# EAGLE design Dashboard rev5 (EAGLE 9.6.2)

## Sheet 1 of 4
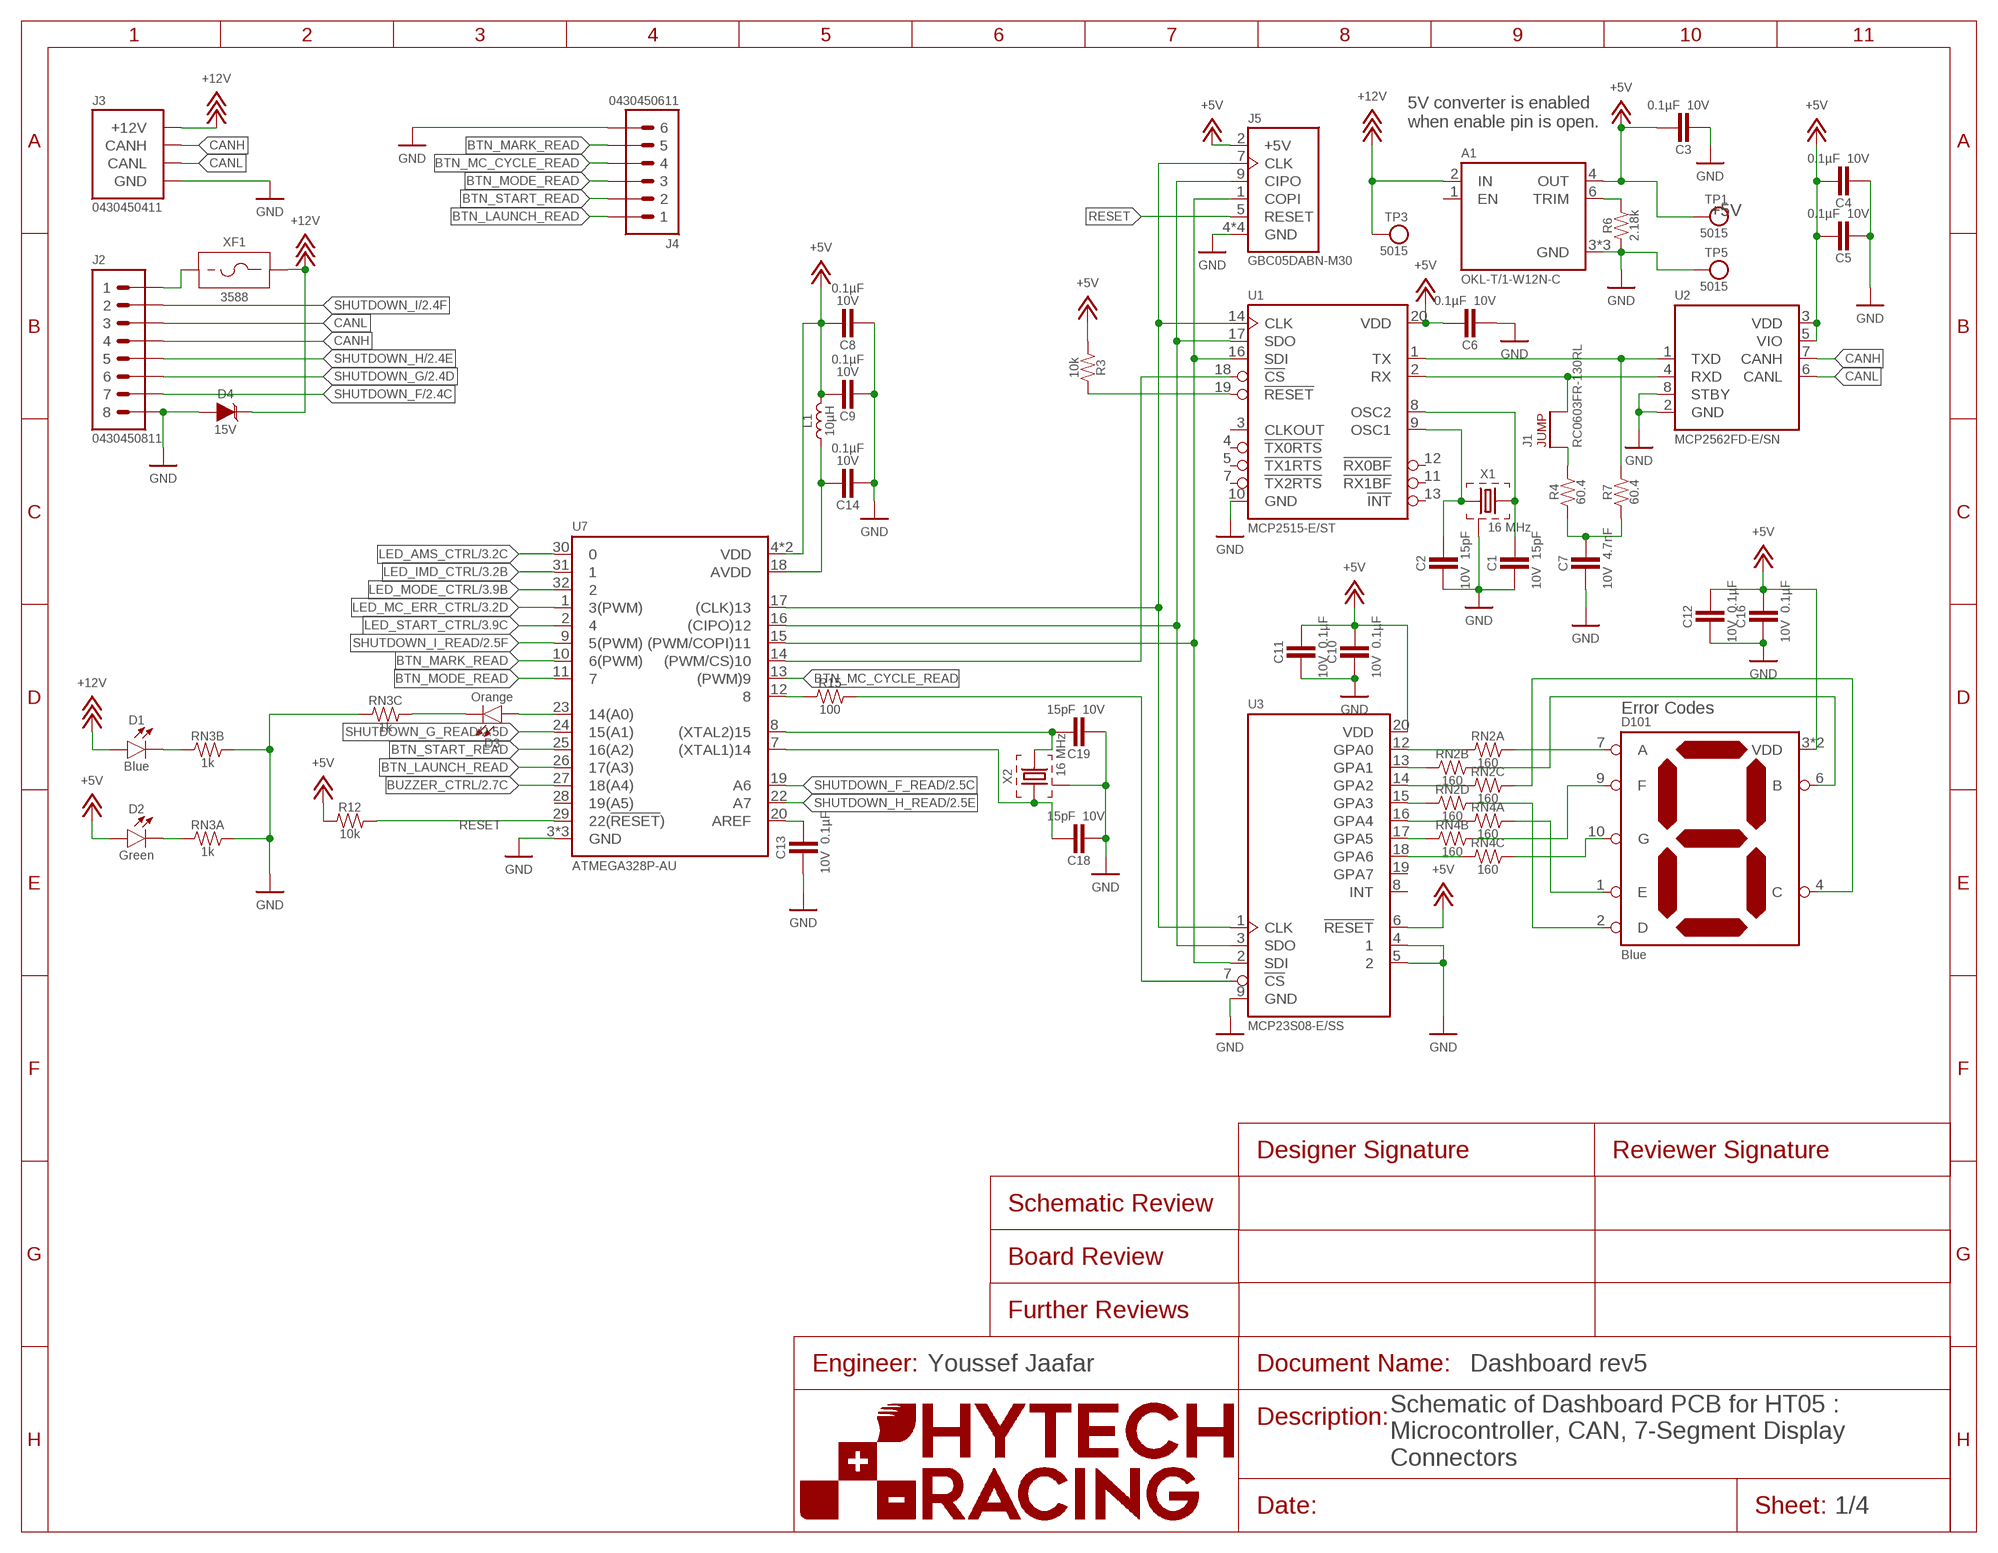
[diagram p0: schematic, sheet 1]

### Parts
A1  OKL-T/1-W12N-COKL  [OKL-T/1-W12]
C1  CAPACITOR_0603_10V_15PF  [0603-CAP]
C2  CAPACITOR_0603_10V_15PF  [0603-CAP]
C3  CAPACITOR_0603_10V_0.1UF  [0603-CAP]
C4  CAPACITOR_0603_10V_0.1UF  [0603-CAP]
C5  CAPACITOR_0603_10V_0.1UF  [0603-CAP]
C6  CAPACITOR_0603_10V_0.1UF  [0603-CAP]
C7  CAPACITOR_0603_10V_4.7NF  [0603-CAP]
C8  CAPACITOR_0603_10V_0.1UF  [0603-CAP]
C9  CAPACITOR_0603_10V_0.1UF  [0603-CAP]
C10  CAPACITOR_0603_10V_0.1UF  [0603-CAP]
C11  CAPACITOR_0603_10V_0.1UF  [0603-CAP]
C12  CAPACITOR_0603_10V_0.1UF  [0603-CAP]
C13  CAPACITOR_0603_10V_0.1UF  [0603-CAP]
C14  CAPACITOR_0603_10V_0.1UF  [0603-CAP]
C16  CAPACITOR_0603_10V_0.1UF  [0603-CAP]
C18  CAPACITOR_0603_10V_15PF  [0603-CAP]
C19  CAPACITOR_0603_10V_15PF  [0603-CAP]
D1  LED_0603_BLUE  [0603-LED]
D2  LED_0603_GREEN  [0603-LED]
D3  LED_0603_ORANGE  [0603-LED]
D4  TVS_15V  [SOT-23]
D101  LED_7_SEGMENT_BLUE_DSM7TA  [DSM7T]
J1  JUMPER_0603_  [0603-RES]
J2  CONNECTOR-8_μF_S_RA_  [MOLEX_MICROFIT_SMD_RIGHTANGLE_08_DUAL]
J3  CONNECTOR-CAN_μF_S_RA_  [MOLEX_MICROFIT_SMD_RIGHTANGLE_04_DUAL]
J4  CONNECTOR-6_μF_S_RA_  [MOLEX_MICROFIT_SMD_RIGHTANGLE_06_DUAL]
J5  CONNECTOR-AVR-ISP_2X05_SMD  [2X05_SMD]
L1  INDUCTOR_LQM18DH100M70_10UH  [0603-IND]
R3  RESISTOR_0603_10K  [0603-RES]
R4  RESISTOR_0603_60.4  [0603-RES]
R6  RESISTOR_0603_2.18K  [0603-RES]
R7  RESISTOR_0603_60.4  [0603-RES]
R12  RESISTOR_0603_10K  [0603-RES]
R15  RESISTOR_0603_100  [0603-RES]
RN2  RESISTOR_NETWORK_4_160  [1206-RES-ARRAY]
RN3  RESISTOR_NETWORK_4_1K  [1206-RES-ARRAY]
RN4  RESISTOR_NETWORK_4_160  [1206-RES-ARRAY]
TP1  TEST_POINT  [5015]
TP3  TEST_POINT  [5015]
TP5  TEST_POINT  [5015]
U1  MCP2515  [TSSOP-20]
U2  MCP2562FD  [SOIC-08(NARROW,0.15")]
U3  MCP23S08  [SSOP-20]
U7  ATMEGA328P-AU  [TQFP-32]
X1  CRYSTAL_16MHZ  [ECX-42]
X2  CRYSTAL_16MHZ  [ECX-42]
XF1  FUSE_HOLDER_MINIBLADESMD  [3588]

### Nets
+5V: A1.4(OUT) C3.1 C4.1 C5.1 C6.1 C8.1 C9.1 C10.1 C11.1 C12.1 C16.1 D2.2(A) D101.3(VDD) D101.8(VDD) J5.2(+5V) L1.2 R3.1 R12.1 TP1.1 U1.20(VDD) U2.3(VDD) U2.5(VIO) U3.6(!RESET) U3.20(VDD) U7.4(VDD) U7.6(VDD) ; also sheet 3
+12V: A1.2(IN) D1.2(A) D4.3(C) J3.1(+12V) TP3.1 XF1.3 XF1.4 ; also sheet 2
A2: RN2.1 U3.12(GPA0)
B2: RN2.2 U3.13(GPA1)
BTN_LAUNCH_READ: J4.1 U7.26(17(A3))
BTN_MARK_READ: J4.5 U7.10(6(PWM))
BTN_MC_CYCLE_READ: J4.4 U7.13((PWM)9)
BTN_MODE_READ: J4.3 U7.11
BTN_START_READ: J4.2 U7.25(16(A2))
BUZZER_CTRL: U7.27(18(A4)) ; also sheet 2
C2: RN2.3 U3.14(GPA2)
CANH: J2.4 J3.4(CANH) U2.7(CANH)
CANL: J2.3 J3.3(CANL) U2.6(CANL)
CIPO: J5.9(CIPO) U1.17(SDO) U3.3(SDO) U7.16((CIPO)12)
CLK: J5.7(CLK) U1.14(CLK) U3.1(CLK) U7.17((CLK)13)
COPI: J5.1(COPI) U1.16(SDI) U3.2(SDI) U7.15((PWM/COPI)11)
CS_CAN: U1.18(!CS) U7.14((PWM/CS)10)
CS_IO: R15.2 U3.7(!CS)
D2: RN2.4 U3.15(GPA3)
E2: RN4.1 U3.16(GPA4)
F2: RN4.2 U3.17(GPA5)
G2: RN4.3 U3.18(GPA6)
GND: A1.3(GND) A1.7(GND) A1.11(GND) C1.2 C2.2 C3.2 C4.2 C5.2 C6.2 C7.2 C8.2 C9.2 C10.2 C11.2 C12.2 C13.2 C14.2 C16.2 C18.2 C19.2 D4.1(A) J2.8 J3.2(GND) J4.6 J5.4(GND) J5.6(GND) J5.8(GND) J5.10(GND) R6.1 RN3.3 RN3.7 RN3.8 TP5.1 U1.10(GND) U2.2(GND) U2.8(STBY) U3.4 U3.5 U3.9(GND) U7.3(GND) U7.5(GND) U7.21(GND) X1.2(GND) X1.4(GND) X2.2(GND) X2.4(GND) ; also sheet 2,3
LED_AMS_CTRL: U7.30 ; also sheet 3
LED_IMD_CTRL: U7.31 ; also sheet 3
LED_MC_ERR_CTRL: U7.1(3(PWM)) ; also sheet 3
LED_MODE_CTRL: U7.32 ; also sheet 3
LED_START_CTRL: U7.2 ; also sheet 3
N$1: C2.1 U1.9(OSC1) X1.1
N$3: C19.1 U7.8((XTAL2)15) X2.3
N$4: C13.1 U7.20(AREF)
N$11: C18.1 U7.7((XTAL1)14) X2.1
N$13: D101.7(A) RN2.8
N$14: D101.6(B) RN2.7
N$15: D101.4(C) RN2.6
N$16: D101.10(G) RN4.6
N$17: D101.9(F) RN4.7
N$18: D101.1(E) RN4.8
N$19: D101.2(D) RN2.5
N$21: D2.1(C) RN3.1
N$29: R15.1 U7.12
N$30: A1.6(TRIM) R6.2
N$41: J1.2 U1.2(RX) U2.4(RXD)
N$42: C1.1 U1.8(OSC2) X1.3
N$43: J2.1 XF1.1 XF1.2
N$44: D3.2(A) U7.23(14(A0))
N$46: R3.2 U1.19(!RESET)
N$51: J1.1 R4.2
N$52: C7.1 R4.1 R7.1
N$53: R7.2 U1.1(TX) U2.1(TXD)
N$60: C14.1 L1.1 U7.18(AVDD)
RESET: J5.5(RESET) R12.2 U7.29(22(!RESET!))
SHUTDOWN_F: J2.7 ; also sheet 2
SHUTDOWN_F_READ: U7.19(A6) ; also sheet 2,3
SHUTDOWN_G: J2.6 ; also sheet 2
SHUTDOWN_G_READ: U7.24(15(A1)) ; also sheet 2,3
SHUTDOWN_H: J2.5 ; also sheet 2
SHUTDOWN_H_READ: U7.22(A7) ; also sheet 2
SHUTDOWN_I: J2.2 ; also sheet 2
SHUTDOWN_I_READ: U7.9(5(PWM)) ; also sheet 2,3
STATUS_12V: D1.1(C) RN3.2
STATUS_TEENSY: D3.1(C) RN3.6
Unconnected: A1.1(EN) RN3.4 RN3.5 RN4.4 RN4.5 U1.3(CLKOUT) U1.4(!TX0RTS) U1.5(!TX1RTS) U1.7(!TX2RTS) U1.11(!RX1BF) U1.12(!RX0BF) U1.13(!INT) U3.8(INT) U3.19(GPA7) U7.28(19(A5))

### Notes on the sheet
- 5V converter is enabled 
  when enable pin is open.
- Error Codes
- Youssef Jaafar
- Schematic of Dashboard PCB for HT05 :
  Microcontroller, CAN, 7-Segment Display
  Connectors

## Sheet 2 of 4
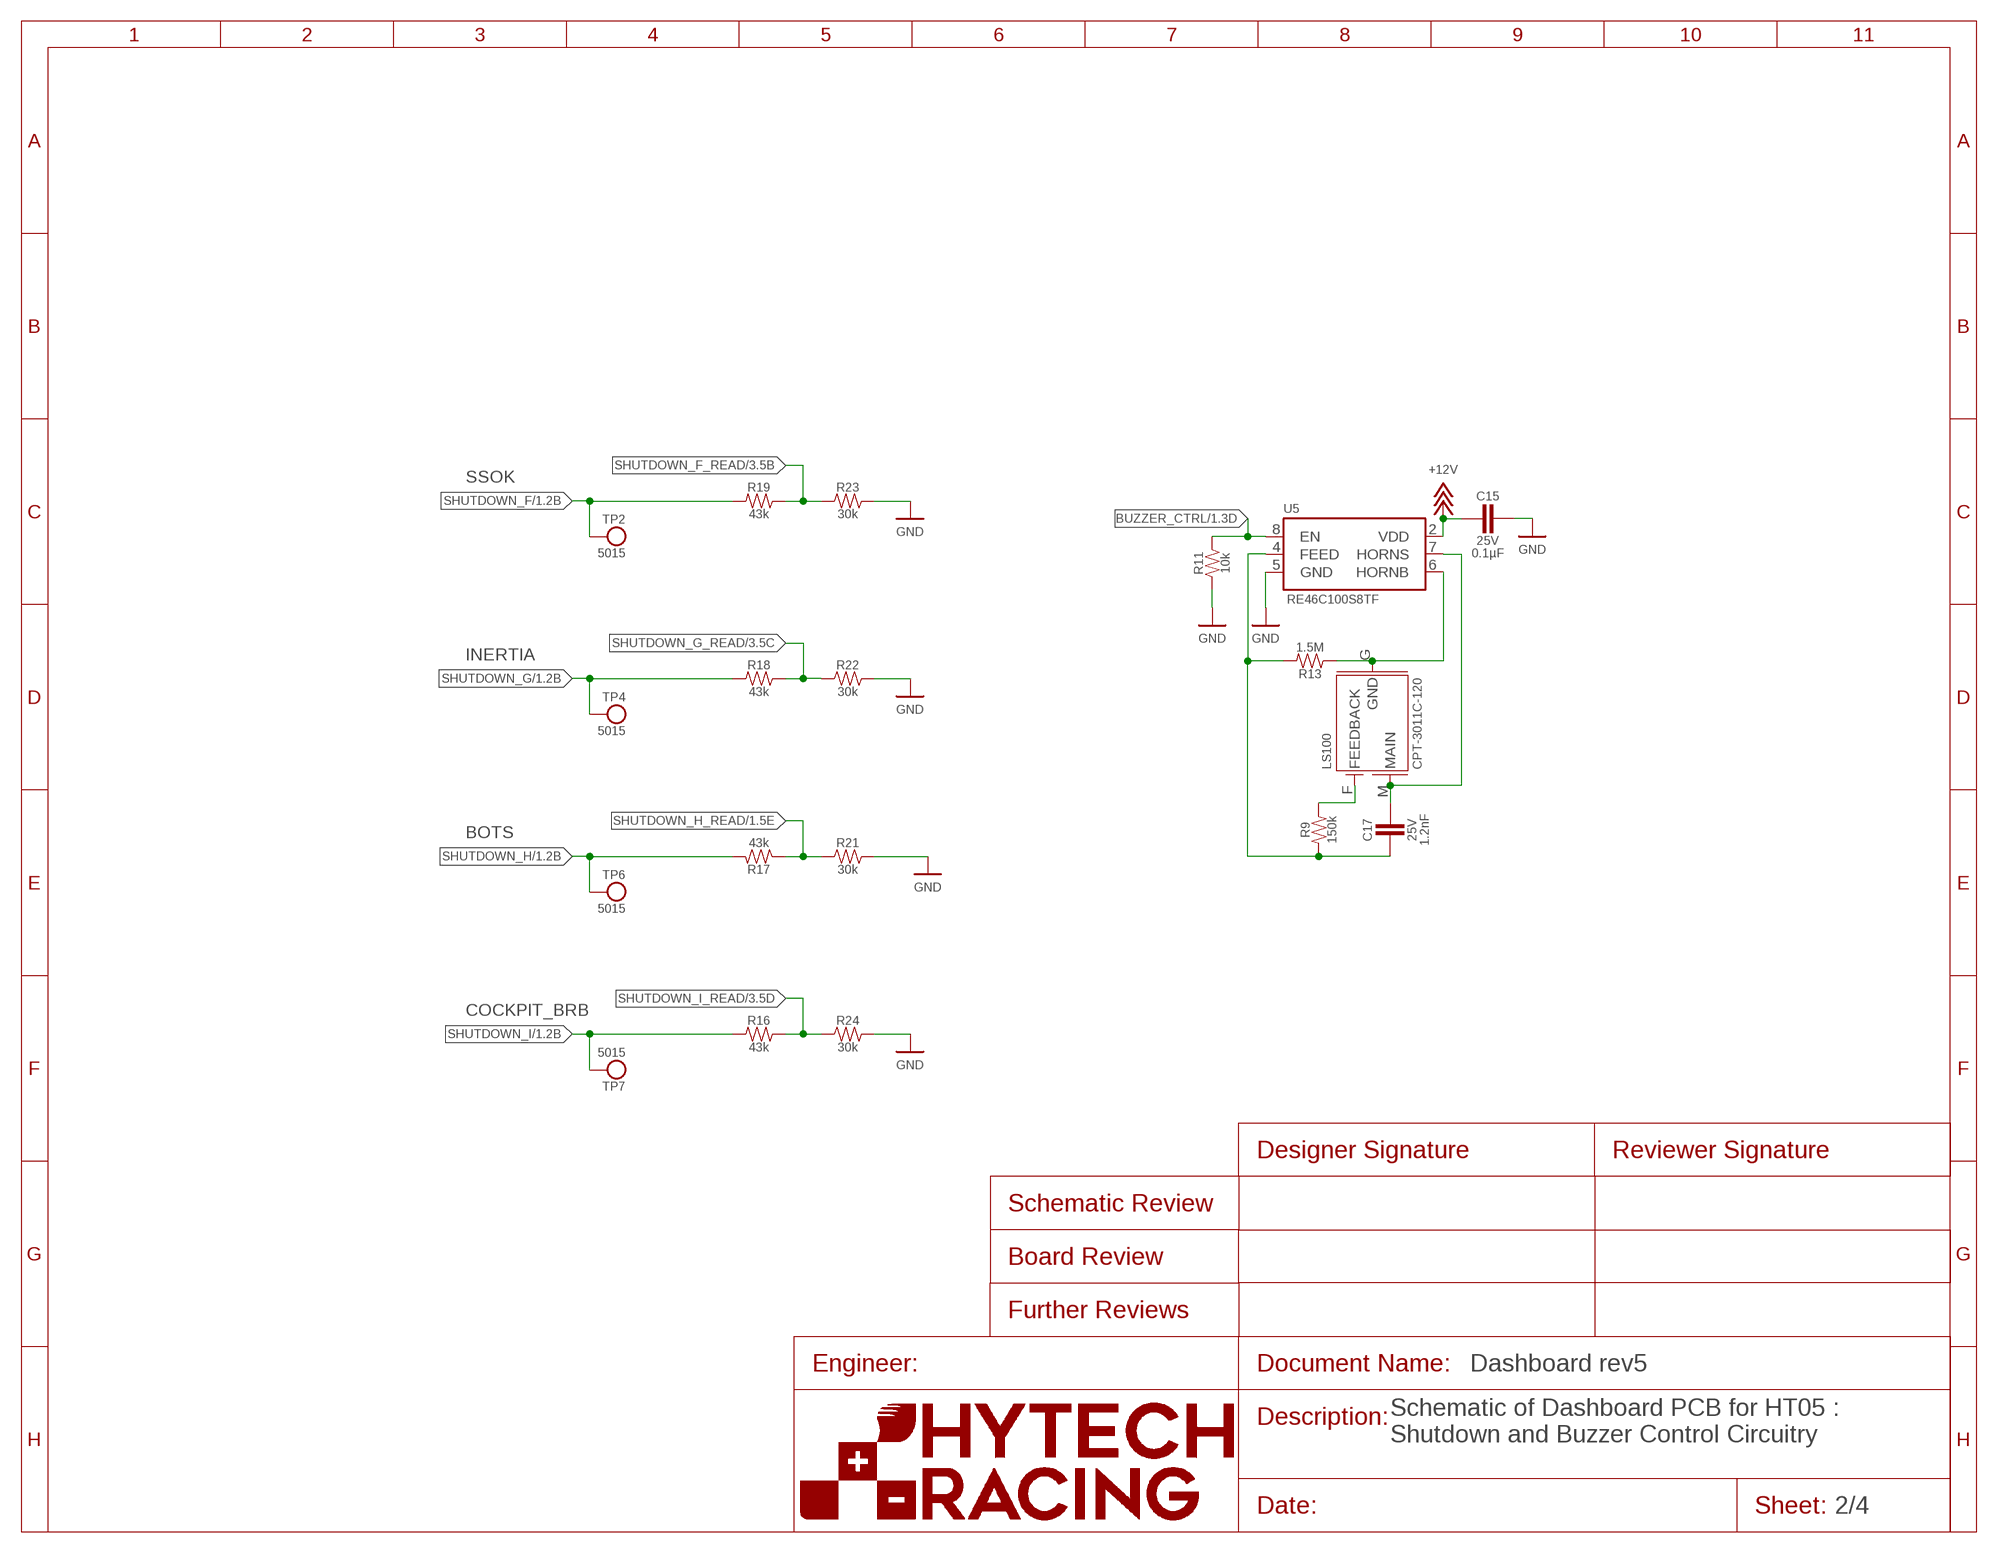
[diagram p1: schematic, sheet 2]

### Parts
C15  CAPACITOR_0603_25V_0.1UF  [0603-CAP]
C17  CAPACITOR_0603_25V_1.2NF  [0603-CAP]
LS100  BUZZER_3_PIN_CPT-3011C-120  [CPT-3011C-120]
R9  RESISTOR_0603_150K  [0603-RES]
R11  RESISTOR_0603_10K  [0603-RES]
R13  RESISTOR_0603_1.5M  [0603-RES]
R16  RESISTOR_0603_43K  [0603-RES]
R17  RESISTOR_0603_43K  [0603-RES]
R18  RESISTOR_0603_43K  [0603-RES]
R19  RESISTOR_0603_43K  [0603-RES]
R21  RESISTOR_0603_30K  [0603-RES]
R22  RESISTOR_0603_30K  [0603-RES]
R23  RESISTOR_0603_30K  [0603-RES]
R24  RESISTOR_0603_30K  [0603-RES]
TP2  TEST_POINT  [5015]
TP4  TEST_POINT  [5015]
TP6  TEST_POINT  [5015]
TP7  TEST_POINT  [5015]
U5  RE46C100  [SOIC-08(NARROW,0.15")]

### Nets
+12V: C15.2 U5.2(VDD) ; also sheet 1
BUZZER_CTRL: R11.2 U5.8(EN) ; also sheet 1
GND: C15.1 R11.1 R21.2 R22.2 R23.2 R24.2 U5.5(GND) ; also sheet 1,3
N$28: C17.1 LS100.M(MAIN) U5.7(HORNS)
N$39: LS100.G(GND) R13.1 U5.6(HORNB)
N$50: C17.2 R9.1 R13.2 U5.4(FEED)
N$54: LS100.F(FEEDBACK) R9.2
SHUTDOWN_F: R19.1 TP2.1 ; also sheet 1
SHUTDOWN_F_READ: R19.2 R23.1 ; also sheet 1,3
SHUTDOWN_G: R18.1 TP4.1 ; also sheet 1
SHUTDOWN_G_READ: R18.2 R22.1 ; also sheet 1,3
SHUTDOWN_H: R17.1 TP6.1 ; also sheet 1
SHUTDOWN_H_READ: R17.2 R21.1 ; also sheet 1
SHUTDOWN_I: R16.1 TP7.1 ; also sheet 1
SHUTDOWN_I_READ: R16.2 R24.1 ; also sheet 1,3

### Notes on the sheet
- SSOK
- INERTIA
- BOTS
- COCKPIT_BRB
- Schematic of Dashboard PCB for HT05 :
  Shutdown and Buzzer Control Circuitry

## Sheet 3 of 4
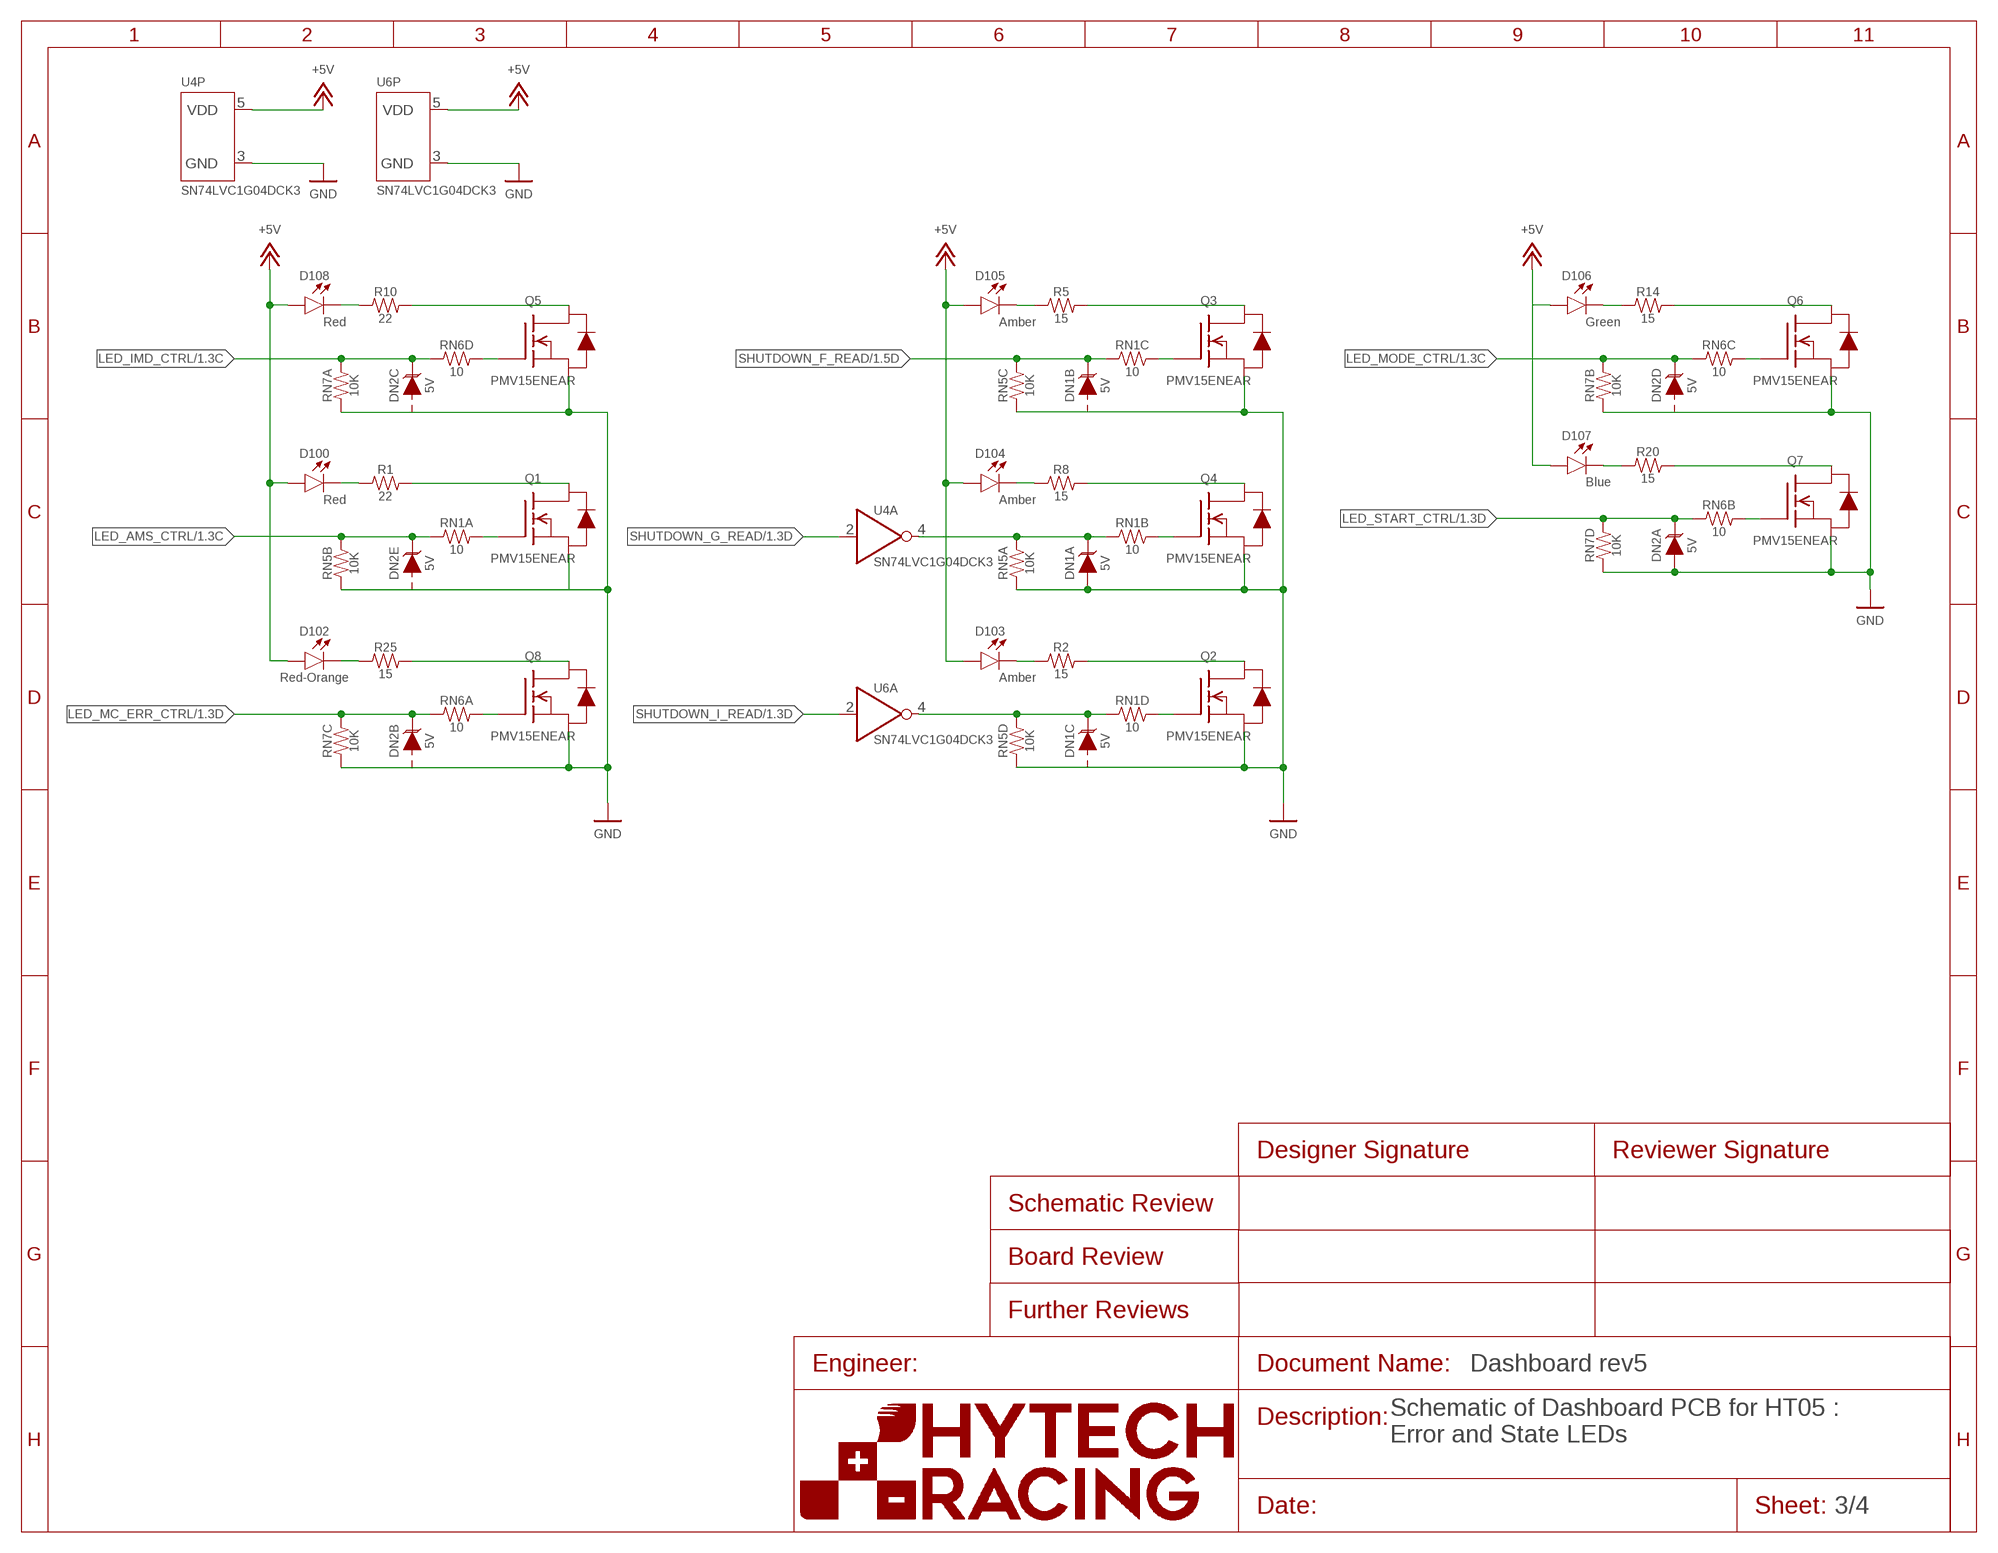
[diagram p2: schematic, sheet 3]

### Parts
D100  LED_2835_RED  [2835-LED]
D102  LED_2835_RED-ORANGE  [2835-LED]
D103  LED_2835_AMBER  [2835-LED]
D104  LED_2835_AMBER  [2835-LED]
D105  LED_2835_AMBER  [2835-LED]
D106  LED_2835_GREEN  [2835-LED]
D107  LED_2835_BLUE  [2835-LED]
D108  LED_2835_RED  [2835-LED]
DN1  TVS_ARRAY_5V  [SOT-363]
DN2  TVS_ARRAY_5V  [SOT-363]
Q1  TRANSISTOR_N_MOS__PMV15ENEA  [SOT-23]
Q2  TRANSISTOR_N_MOS__PMV15ENEA  [SOT-23]
Q3  TRANSISTOR_N_MOS__PMV15ENEA  [SOT-23]
Q4  TRANSISTOR_N_MOS__PMV15ENEA  [SOT-23]
Q5  TRANSISTOR_N_MOS__PMV15ENEA  [SOT-23]
Q6  TRANSISTOR_N_MOS__PMV15ENEA  [SOT-23]
Q7  TRANSISTOR_N_MOS__PMV15ENEA  [SOT-23]
Q8  TRANSISTOR_N_MOS__PMV15ENEA  [SOT-23]
R1  RESISTOR_0805_22  [0805-RES]
R2  RESISTOR_0603_15  [0603-RES]
R5  RESISTOR_0603_15  [0603-RES]
R8  RESISTOR_0603_15  [0603-RES]
R10  RESISTOR_0805_22  [0805-RES]
R14  RESISTOR_0603_15  [0603-RES]
R20  RESISTOR_0603_15  [0603-RES]
R25  RESISTOR_0603_15  [0603-RES]
RN1  RESISTOR_NETWORK_4_10  [1206-RES-ARRAY]
RN5  RESISTOR_NETWORK_4_10K  [1206-RES-ARRAY]
RN6  RESISTOR_NETWORK_4_10  [1206-RES-ARRAY]
RN7  RESISTOR_NETWORK_4_10K  [1206-RES-ARRAY]
U4  LOGICGATE_INVERTER_DCK3  [SC-70-5]
U6  LOGICGATE_INVERTER_DCK3  [SC-70-5]

### Nets
+5V: D100.A D102.A D103.A D104.A D105.A D106.A D107.A D108.A U4.5(P:VDD) U6.5(P:VDD) ; also sheet 1
AMS_LED-: D100.C R1.1
BRB_LED-: D103.C R2.1
GND: DN1.2(A:A) DN2.2(A:A) Q1.2(S) Q2.2(S) Q3.2(S) Q4.2(S) Q5.2(S) Q6.2(S) Q7.2(S) Q8.2(S) RN5.1 RN5.2 RN5.3 RN5.4 RN7.1 RN7.2 RN7.3 RN7.4 U4.3(P:GND) U6.3(P:GND) ; also sheet 1,2
IMD_LED-: D108.C R10.1
LED_AMS_CTRL: DN2.6(E:C) RN1.1 RN5.7 ; also sheet 1
LED_IMD_CTRL: DN2.4(C:C) RN6.4 RN7.8 ; also sheet 1
LED_MC_ERR_CTRL: DN2.3(B:C) RN6.1 RN7.6 ; also sheet 1
LED_MODE_CTRL: DN2.5(D:C) RN6.3 RN7.7 ; also sheet 1
LED_START_CTRL: DN2.1(A:C) RN6.2 RN7.5 ; also sheet 1
MCU_LED-: D102.C R25.1
MODE_LED-: D106.C R14.1
N$5: Q8.3(D) R25.2
N$6: Q6.3(D) R14.2
N$7: Q5.3(D) R10.2
N$8: Q1.3(D) R1.2
N$9: Q4.3(D) R8.2
N$10: Q7.1(G) RN6.7
N$12: Q2.1(G) RN1.5
N$22: Q8.1(G) RN6.8
N$23: Q2.3(D) R2.2
N$26: Q3.1(G) RN1.6
N$34: Q7.3(D) R20.2
N$35: Q5.1(G) RN6.5
N$36: Q6.1(G) RN6.6
N$37: Q4.1(G) RN1.7
N$38: Q1.1(G) RN1.8
N$48: DN1.1(A:C) RN1.2 RN5.8 U4.4(A:!IN)
N$55: Q3.3(D) R5.2
N$56: DN1.4(C:C) RN1.4 RN5.5 U6.4(A:!IN)
S/D_F_LED-: D105.C R5.1
S/D_G_LED-: D104.C R8.1
SHUTDOWN_F_READ: DN1.3(B:C) RN1.3 RN5.6 ; also sheet 1,2
SHUTDOWN_G_READ: U4.2(A:IN) ; also sheet 1,2
SHUTDOWN_I_READ: U6.2(A:IN) ; also sheet 1,2
START_LED-: D107.C R20.1
Unconnected: DN1.5(D:C) DN1.6(E:C)

### Notes on the sheet
- Schematic of Dashboard PCB for HT05 :
  Error and State LEDs

## Sheet 4 of 4
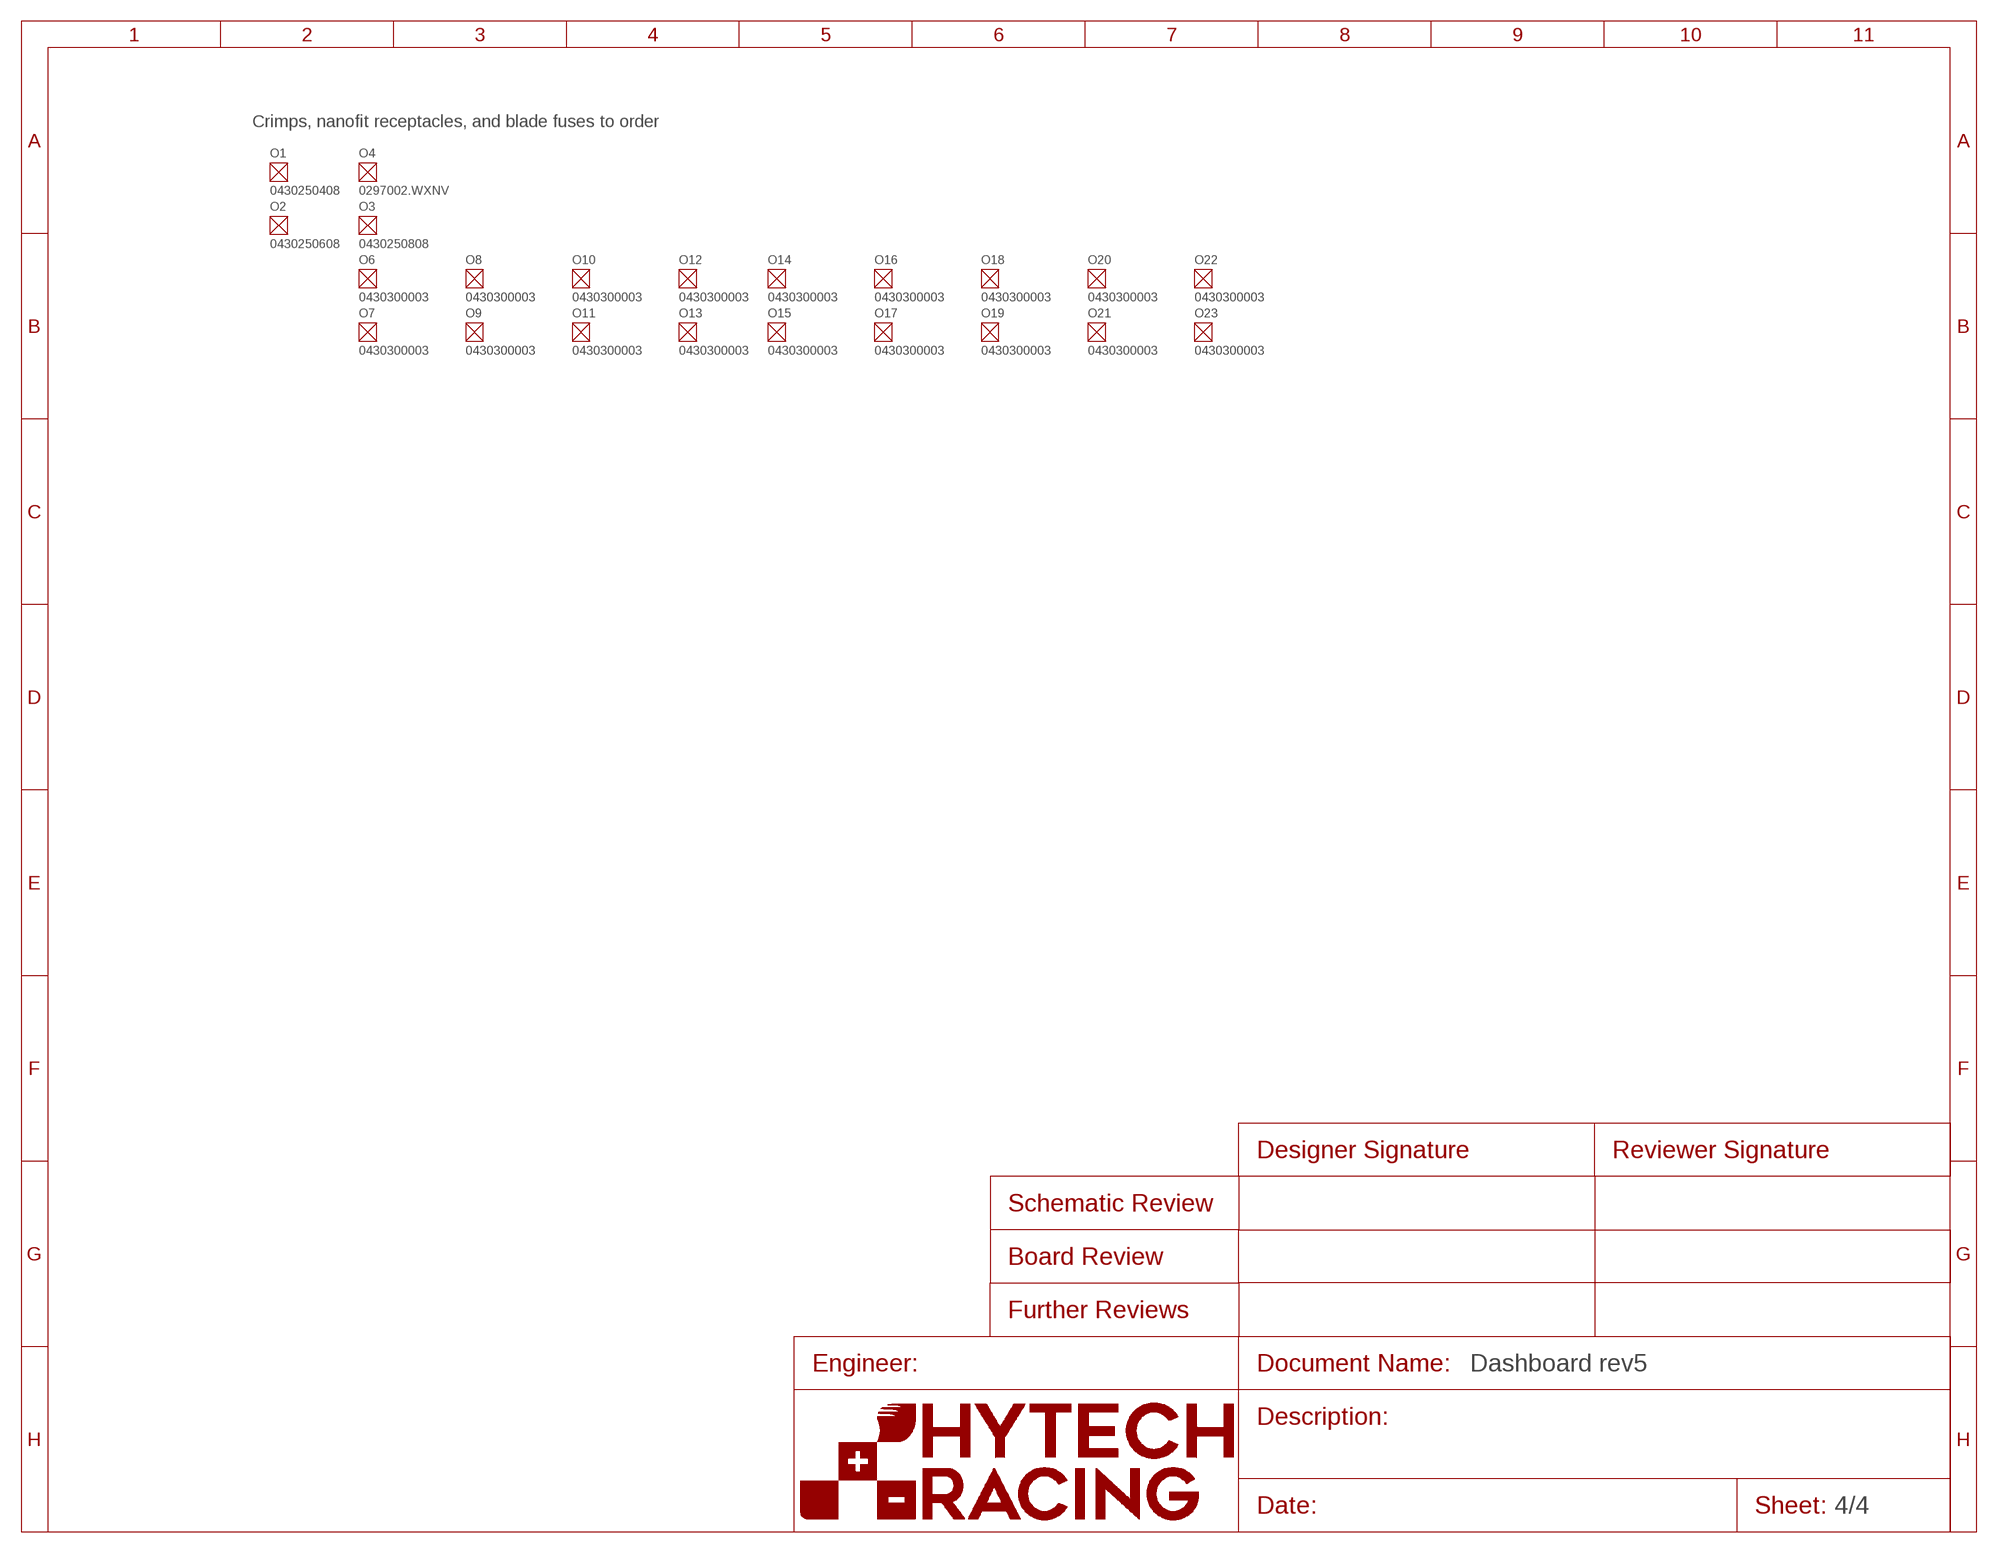
[diagram p3: schematic, sheet 4]
O1 (RECEPTACLE-4_MICROFIT): DKPN: WM11225-ND; MANUFACTURER: Molex; MOPN: 538-43025-0408; MPN: 0430250408
O2 (RECEPTACLE-6_MICROFIT): DKPN: WM13209-ND; MANUFACTURER: Molex; MOPN: 538-43025-0608; MPN: 0430250608
O3 (RECEPTACLE-8_MICROFIT): DKPN: WM13210-ND; MANUFACTURER: Molex; MOPN: 538-43025-0808; MPN: 0430250808
O4 (FUSE_MINI_BLADE_2): CURRENT: 2A; DKPN: F986-ND; FUSE_TYPE: MINI 297; MANUFACTURER: Littelfuse Inc.; MOPN: 576-0297002.WXNV; MPN: 0297002.WXNV
O6 (CRIMP_MICROFIT_20-24): DKPN: WM2776CT-ND; GAUGE: 20-24; MANUFACTURER: Molex; MOPN: 538-43030-0003; MPN: 0430300003
O7 (CRIMP_MICROFIT_20-24): DKPN: WM2776CT-ND; GAUGE: 20-24; MANUFACTURER: Molex; MOPN: 538-43030-0003; MPN: 0430300003
O8 (CRIMP_MICROFIT_20-24): DKPN: WM2776CT-ND; GAUGE: 20-24; MANUFACTURER: Molex; MOPN: 538-43030-0003; MPN: 0430300003
O9 (CRIMP_MICROFIT_20-24): DKPN: WM2776CT-ND; GAUGE: 20-24; MANUFACTURER: Molex; MOPN: 538-43030-0003; MPN: 0430300003
O10 (CRIMP_MICROFIT_20-24): DKPN: WM2776CT-ND; GAUGE: 20-24; MANUFACTURER: Molex; MOPN: 538-43030-0003; MPN: 0430300003
O11 (CRIMP_MICROFIT_20-24): DKPN: WM2776CT-ND; GAUGE: 20-24; MANUFACTURER: Molex; MOPN: 538-43030-0003; MPN: 0430300003
O12 (CRIMP_MICROFIT_20-24): DKPN: WM2776CT-ND; GAUGE: 20-24; MANUFACTURER: Molex; MOPN: 538-43030-0003; MPN: 0430300003
O13 (CRIMP_MICROFIT_20-24): DKPN: WM2776CT-ND; GAUGE: 20-24; MANUFACTURER: Molex; MOPN: 538-43030-0003; MPN: 0430300003
O14 (CRIMP_MICROFIT_20-24): DKPN: WM2776CT-ND; GAUGE: 20-24; MANUFACTURER: Molex; MOPN: 538-43030-0003; MPN: 0430300003
O15 (CRIMP_MICROFIT_20-24): DKPN: WM2776CT-ND; GAUGE: 20-24; MANUFACTURER: Molex; MOPN: 538-43030-0003; MPN: 0430300003
O16 (CRIMP_MICROFIT_20-24): DKPN: WM2776CT-ND; GAUGE: 20-24; MANUFACTURER: Molex; MOPN: 538-43030-0003; MPN: 0430300003
O17 (CRIMP_MICROFIT_20-24): DKPN: WM2776CT-ND; GAUGE: 20-24; MANUFACTURER: Molex; MOPN: 538-43030-0003; MPN: 0430300003
O18 (CRIMP_MICROFIT_20-24): DKPN: WM2776CT-ND; GAUGE: 20-24; MANUFACTURER: Molex; MOPN: 538-43030-0003; MPN: 0430300003
O19 (CRIMP_MICROFIT_20-24): DKPN: WM2776CT-ND; GAUGE: 20-24; MANUFACTURER: Molex; MOPN: 538-43030-0003; MPN: 0430300003
O20 (CRIMP_MICROFIT_20-24): DKPN: WM2776CT-ND; GAUGE: 20-24; MANUFACTURER: Molex; MOPN: 538-43030-0003; MPN: 0430300003
O21 (CRIMP_MICROFIT_20-24): DKPN: WM2776CT-ND; GAUGE: 20-24; MANUFACTURER: Molex; MOPN: 538-43030-0003; MPN: 0430300003
O22 (CRIMP_MICROFIT_20-24): DKPN: WM2776CT-ND; GAUGE: 20-24; MANUFACTURER: Molex; MOPN: 538-43030-0003; MPN: 0430300003
O23 (CRIMP_MICROFIT_20-24): DKPN: WM2776CT-ND; GAUGE: 20-24; MANUFACTURER: Molex; MOPN: 538-43030-0003; MPN: 0430300003

### Notes on the sheet
- Crimps, nanofit receptacles, and blade fuses to order

## Library data of the parts
A1 = HyTechDevices:OKL-*: Point of Load Voltage Regulator Modules OKL-T/1-W12 Datasheet <https://www.murata.com/products/productdata/8807038124062/okl-t1-w12.pdf?1583754815000>; DKPN: 811-2260-2-ND; MANUFACTURER: Murata Power Solutions Inc.; MOPN: 580-OKL-T/1-W12N-C; MPN: OKL-T/1-W12N-C; VIN: 12V; VOUT: 5V
C1 C2 C18 C19 = HyTechDevices:CAPACITOR_?_*: Capacitor, Non-Polarized VJ...1BC Series Datasheet <https://www.mouser.com/datasheet/2/427/vjw1bcbascomseries-1762447.pdf> Samsung Datasheet <https://www.mouser.com/datasheet/2/585/MLCC-1837944.pdf> Walsin Datasheet <https://www.mouser.com/datasheet/2/210/WTC_MLCC_General_Purpose-1534899.pdf> GRM188R61A226ME15D <https://www.mouser.com/datasheet/2/281/1/GRM188R61A226ME15_02A-1985787.pdf> GRM188R61E106MA73D <https://www.mouser.com/datasheet/2/281/1/GRM188R61E106MA73_01A-1985806.pdf> 885012006013 <https://www.mouser.com/datasheet/2/445/885012006013-1726946.pdf> 2220Y6300105KXTWS2 <https://www.mouser.com/datasheet/2/218/SMD_High_and_Std_StackiCap_P62-1825512.pdf> Yageo Class 2, X5R <https://www.mouser.com/datasheet/2/447/UPY_GPHC_X5R_4V_to_50V_26-1827097.pdf> TDK C Series <https://www.mouser.com/ProductDetail/TDK/C3216X5R1V226M160AC?qs=%2Fha2pyFadujbcx9jh7lYl%2F4NeMoXFhdc8AqVWNq4wW6M2y7zl6GzBuhgtI0ngznN> AVX Automotive MLCC <https://www.mouser.com/datasheet/2/40/AutoMLCC-777028.pdf> KEMET X7R Series <https://www.mouser.com/datasheet/2/212/KEM_C1002_X7R_SMD-1102033.pdf> Kyocera AVX <https://www.mouser.com/datasheet/2/40/C0GNP0_Dielectric-951274.pdf>; CAPACITANCE: 15pF; DKPN: 720-VJ0603A150FXQPW1BCCT-ND; MANUFACTURER: Vishay Vitramon; MOPN: 77-VJ0603A150FXQPBC; MPN: VJ0603A150FXQPW1BC; TOLERANCE: 1%; VOLTAGE: 10V
C3-C6 C8-C14 C16 = HyTechDevices:CAPACITOR_?_*: Capacitor, Non-Polarized VJ...1BC Series Datasheet <https://www.mouser.com/datasheet/2/427/vjw1bcbascomseries-1762447.pdf> Samsung Datasheet <https://www.mouser.com/datasheet/2/585/MLCC-1837944.pdf> Walsin Datasheet <https://www.mouser.com/datasheet/2/210/WTC_MLCC_General_Purpose-1534899.pdf> GRM188R61A226ME15D <https://www.mouser.com/datasheet/2/281/1/GRM188R61A226ME15_02A-1985787.pdf> GRM188R61E106MA73D <https://www.mouser.com/datasheet/2/281/1/GRM188R61E106MA73_01A-1985806.pdf> 885012006013 <https://www.mouser.com/datasheet/2/445/885012006013-1726946.pdf> 2220Y6300105KXTWS2 <https://www.mouser.com/datasheet/2/218/SMD_High_and_Std_StackiCap_P62-1825512.pdf> Yageo Class 2, X5R <https://www.mouser.com/datasheet/2/447/UPY_GPHC_X5R_4V_to_50V_26-1827097.pdf> TDK C Series <https://www.mouser.com/ProductDetail/TDK/C3216X5R1V226M160AC?qs=%2Fha2pyFadujbcx9jh7lYl%2F4NeMoXFhdc8AqVWNq4wW6M2y7zl6GzBuhgtI0ngznN> AVX Automotive MLCC <https://www.mouser.com/datasheet/2/40/AutoMLCC-777028.pdf> KEMET X7R Series <https://www.mouser.com/datasheet/2/212/KEM_C1002_X7R_SMD-1102033.pdf> Kyocera AVX <https://www.mouser.com/datasheet/2/40/C0GNP0_Dielectric-951274.pdf>; CAPACITANCE: 0.1µF; DKPN: 720-1688-1-ND; MANUFACTURER: Vishay Vitramon; MOPN: 77-VJ0603Y104JXQPBC; MPN: VJ0603Y104JXQPW1BC; TOLERANCE: 5%; VOLTAGE: 10V
C7 = HyTechDevices:CAPACITOR_?_*: Capacitor, Non-Polarized VJ...1BC Series Datasheet <https://www.mouser.com/datasheet/2/427/vjw1bcbascomseries-1762447.pdf> Samsung Datasheet <https://www.mouser.com/datasheet/2/585/MLCC-1837944.pdf> Walsin Datasheet <https://www.mouser.com/datasheet/2/210/WTC_MLCC_General_Purpose-1534899.pdf> GRM188R61A226ME15D <https://www.mouser.com/datasheet/2/281/1/GRM188R61A226ME15_02A-1985787.pdf> GRM188R61E106MA73D <https://www.mouser.com/datasheet/2/281/1/GRM188R61E106MA73_01A-1985806.pdf> 885012006013 <https://www.mouser.com/datasheet/2/445/885012006013-1726946.pdf> 2220Y6300105KXTWS2 <https://www.mouser.com/datasheet/2/218/SMD_High_and_Std_StackiCap_P62-1825512.pdf> Yageo Class 2, X5R <https://www.mouser.com/datasheet/2/447/UPY_GPHC_X5R_4V_to_50V_26-1827097.pdf> TDK C Series <https://www.mouser.com/ProductDetail/TDK/C3216X5R1V226M160AC?qs=%2Fha2pyFadujbcx9jh7lYl%2F4NeMoXFhdc8AqVWNq4wW6M2y7zl6GzBuhgtI0ngznN> AVX Automotive MLCC <https://www.mouser.com/datasheet/2/40/AutoMLCC-777028.pdf> KEMET X7R Series <https://www.mouser.com/datasheet/2/212/KEM_C1002_X7R_SMD-1102033.pdf> Kyocera AVX <https://www.mouser.com/datasheet/2/40/C0GNP0_Dielectric-951274.pdf>; CAPACITANCE: 4.7nF; DKPN: 732-7931-1-ND; MANUFACTURER: Würth Elektronik; MOPN: 710-885012206012; MPN: 885012206012; TOLERANCE: 10%; VOLTAGE: 10V
C15 = HyTechDevices:CAPACITOR_?_*: Capacitor, Non-Polarized VJ...1BC Series Datasheet <https://www.mouser.com/datasheet/2/427/vjw1bcbascomseries-1762447.pdf> Samsung Datasheet <https://www.mouser.com/datasheet/2/585/MLCC-1837944.pdf> Walsin Datasheet <https://www.mouser.com/datasheet/2/210/WTC_MLCC_General_Purpose-1534899.pdf> GRM188R61A226ME15D <https://www.mouser.com/datasheet/2/281/1/GRM188R61A226ME15_02A-1985787.pdf> GRM188R61E106MA73D <https://www.mouser.com/datasheet/2/281/1/GRM188R61E106MA73_01A-1985806.pdf> 885012006013 <https://www.mouser.com/datasheet/2/445/885012006013-1726946.pdf> 2220Y6300105KXTWS2 <https://www.mouser.com/datasheet/2/218/SMD_High_and_Std_StackiCap_P62-1825512.pdf> Yageo Class 2, X5R <https://www.mouser.com/datasheet/2/447/UPY_GPHC_X5R_4V_to_50V_26-1827097.pdf> TDK C Series <https://www.mouser.com/ProductDetail/TDK/C3216X5R1V226M160AC?qs=%2Fha2pyFadujbcx9jh7lYl%2F4NeMoXFhdc8AqVWNq4wW6M2y7zl6GzBuhgtI0ngznN> AVX Automotive MLCC <https://www.mouser.com/datasheet/2/40/AutoMLCC-777028.pdf> KEMET X7R Series <https://www.mouser.com/datasheet/2/212/KEM_C1002_X7R_SMD-1102033.pdf> Kyocera AVX <https://www.mouser.com/datasheet/2/40/C0GNP0_Dielectric-951274.pdf>; CAPACITANCE: 0.1µF; DKPN: 1276-1006-1-ND; MANUFACTURER: Samsung Electro-Mechanics; MOPN: 187-CL10B104KA8NNNC; MPN: CL10B104KA8NNNC; TOLERANCE: 10%; VOLTAGE: 25V
C17 = HyTechDevices:CAPACITOR_?_*: Capacitor, Non-Polarized VJ...1BC Series Datasheet <https://www.mouser.com/datasheet/2/427/vjw1bcbascomseries-1762447.pdf> Samsung Datasheet <https://www.mouser.com/datasheet/2/585/MLCC-1837944.pdf> Walsin Datasheet <https://www.mouser.com/datasheet/2/210/WTC_MLCC_General_Purpose-1534899.pdf> GRM188R61A226ME15D <https://www.mouser.com/datasheet/2/281/1/GRM188R61A226ME15_02A-1985787.pdf> GRM188R61E106MA73D <https://www.mouser.com/datasheet/2/281/1/GRM188R61E106MA73_01A-1985806.pdf> 885012006013 <https://www.mouser.com/datasheet/2/445/885012006013-1726946.pdf> 2220Y6300105KXTWS2 <https://www.mouser.com/datasheet/2/218/SMD_High_and_Std_StackiCap_P62-1825512.pdf> Yageo Class 2, X5R <https://www.mouser.com/datasheet/2/447/UPY_GPHC_X5R_4V_to_50V_26-1827097.pdf> TDK C Series <https://www.mouser.com/ProductDetail/TDK/C3216X5R1V226M160AC?qs=%2Fha2pyFadujbcx9jh7lYl%2F4NeMoXFhdc8AqVWNq4wW6M2y7zl6GzBuhgtI0ngznN> AVX Automotive MLCC <https://www.mouser.com/datasheet/2/40/AutoMLCC-777028.pdf> KEMET X7R Series <https://www.mouser.com/datasheet/2/212/KEM_C1002_X7R_SMD-1102033.pdf> Kyocera AVX <https://www.mouser.com/datasheet/2/40/C0GNP0_Dielectric-951274.pdf>; CAPACITANCE: 1.2nF; DKPN: 311-4079-2-ND; MANUFACTURER: YAGEO; MOPN: 603-CC603KRX7R8BB122; MPN: CC0603KRX7R8BB122; TOLERANCE: 10%; VOLTAGE: 25V
D1 = HyTechDevices:LED_?_*: LED 0603 Blue <https://www.mouser.com/datasheet/2/216/APT1608VBC_D-246010.pdf> Green <https://www.mouser.com/datasheet/2/216/APT1608ZGCK-1173388.pdf> Orange <https://www.mouser.com/datasheet/2/216/APT1608SECK-6197.pdf> Red <https://www.mouser.com/datasheet/2/216/APT1608SECK-J3-PRV-1173336.pdf> White <https://www.mouser.com/datasheet/2/50/SM0603UWC-880813.pdf> Yellow <https://www.mouser.com/datasheet/2/216/APT1608SYCK-J3-PRV-1173311.pdf> 2835 (Series not on Digikey) Lumiled LUXEON 2835 Color Line <https://www.mouser.com/datasheet/2/602/DS236_luxeon_2835_color_line_datasheet-1596094.pdf>; COLOR: Blue; DKPN: 754-1789-1-ND; MANUFACTURER: Kingbright; MOPN: 604-APT1608VBC/D; MPN: APT1608VBC/D
D2 = HyTechDevices:LED_?_*: LED 0603 Blue <https://www.mouser.com/datasheet/2/216/APT1608VBC_D-246010.pdf> Green <https://www.mouser.com/datasheet/2/216/APT1608ZGCK-1173388.pdf> Orange <https://www.mouser.com/datasheet/2/216/APT1608SECK-6197.pdf> Red <https://www.mouser.com/datasheet/2/216/APT1608SECK-J3-PRV-1173336.pdf> White <https://www.mouser.com/datasheet/2/50/SM0603UWC-880813.pdf> Yellow <https://www.mouser.com/datasheet/2/216/APT1608SYCK-J3-PRV-1173311.pdf> 2835 (Series not on Digikey) Lumiled LUXEON 2835 Color Line <https://www.mouser.com/datasheet/2/602/DS236_luxeon_2835_color_line_datasheet-1596094.pdf>; COLOR: Green; DKPN: 754-1790-1-ND; MANUFACTURER: Kingbright; MOPN: 604-APT1608ZGCK; MPN: APT1608ZGCK
D3 = HyTechDevices:LED_?_*: LED 0603 Blue <https://www.mouser.com/datasheet/2/216/APT1608VBC_D-246010.pdf> Green <https://www.mouser.com/datasheet/2/216/APT1608ZGCK-1173388.pdf> Orange <https://www.mouser.com/datasheet/2/216/APT1608SECK-6197.pdf> Red <https://www.mouser.com/datasheet/2/216/APT1608SECK-J3-PRV-1173336.pdf> White <https://www.mouser.com/datasheet/2/50/SM0603UWC-880813.pdf> Yellow <https://www.mouser.com/datasheet/2/216/APT1608SYCK-J3-PRV-1173311.pdf> 2835 (Series not on Digikey) Lumiled LUXEON 2835 Color Line <https://www.mouser.com/datasheet/2/602/DS236_luxeon_2835_color_line_datasheet-1596094.pdf>; COLOR: Orange; DKPN: 754-1120-1-ND; MANUFACTURER: Kingbright; MOPN: 604-APT1608SECK; MPN: APT1608SECK
D4 = HyTechDevices:TVS_*: TVS Diode GSOT Datasheet <https://www.mouser.com/datasheet/2/427/gsot03-1767593.pdf>; DKPN: GSOT15-E3-08CT-ND; MANUFACTURER: Vishay General Semiconductor - Diodes Division; MOPN: 78-GSOT15-E3-08; MPN: GSOT15-E3-08; VOLTAGE: 15V
D100 D108 = HyTechDevices:LED_?_*: LED 0603 Blue <https://www.mouser.com/datasheet/2/216/APT1608VBC_D-246010.pdf> Green <https://www.mouser.com/datasheet/2/216/APT1608ZGCK-1173388.pdf> Orange <https://www.mouser.com/datasheet/2/216/APT1608SECK-6197.pdf> Red <https://www.mouser.com/datasheet/2/216/APT1608SECK-J3-PRV-1173336.pdf> White <https://www.mouser.com/datasheet/2/50/SM0603UWC-880813.pdf> Yellow <https://www.mouser.com/datasheet/2/216/APT1608SYCK-J3-PRV-1173311.pdf> 2835 (Series not on Digikey) Lumiled LUXEON 2835 Color Line <https://www.mouser.com/datasheet/2/602/DS236_luxeon_2835_color_line_datasheet-1596094.pdf>; COLOR: Red; MANUFACTURER: Lumileds; MOPN: 997-L128RED10350; MPN: L128-RED1003500000
D101 = HyTechDevices:LED_7_SEGMENT_: Low-Profile 7-Segment Display DSM7T Blue <https://vcclite.com/wp-content/uploads/wpallimport/files/files/DSM7TA56106T.pdf> DSM7T Green <https://vcclite.com/wp-content/uploads/wpallimport/files/files/DSM7TA56105T.pdf>; COLOR: Blue; DKPN: DSM7TA56106TTR-ND; MANUFACTURER: Visual Communications Company; MOPN: 593-DSM7TA56106T; MPN: DSM7TA56106T
D102 = HyTechDevices:LED_?_*: LED 0603 Blue <https://www.mouser.com/datasheet/2/216/APT1608VBC_D-246010.pdf> Green <https://www.mouser.com/datasheet/2/216/APT1608ZGCK-1173388.pdf> Orange <https://www.mouser.com/datasheet/2/216/APT1608SECK-6197.pdf> Red <https://www.mouser.com/datasheet/2/216/APT1608SECK-J3-PRV-1173336.pdf> White <https://www.mouser.com/datasheet/2/50/SM0603UWC-880813.pdf> Yellow <https://www.mouser.com/datasheet/2/216/APT1608SYCK-J3-PRV-1173311.pdf> 2835 (Series not on Digikey) Lumiled LUXEON 2835 Color Line <https://www.mouser.com/datasheet/2/602/DS236_luxeon_2835_color_line_datasheet-1596094.pdf>; COLOR: Red-Orange; MANUFACTURER: Lumileds; MOPN: 997-L128RNG10350; MPN: L128-RNG1003500000
D103-D105 = HyTechDevices:LED_?_*: LED 0603 Blue <https://www.mouser.com/datasheet/2/216/APT1608VBC_D-246010.pdf> Green <https://www.mouser.com/datasheet/2/216/APT1608ZGCK-1173388.pdf> Orange <https://www.mouser.com/datasheet/2/216/APT1608SECK-6197.pdf> Red <https://www.mouser.com/datasheet/2/216/APT1608SECK-J3-PRV-1173336.pdf> White <https://www.mouser.com/datasheet/2/50/SM0603UWC-880813.pdf> Yellow <https://www.mouser.com/datasheet/2/216/APT1608SYCK-J3-PRV-1173311.pdf> 2835 (Series not on Digikey) Lumiled LUXEON 2835 Color Line <https://www.mouser.com/datasheet/2/602/DS236_luxeon_2835_color_line_datasheet-1596094.pdf>; COLOR: Amber; MANUFACTURER: Lumileds; MOPN: 997-L128PCA10350; MPN: L128-PCA1003500000
D106 = HyTechDevices:LED_?_*: LED 0603 Blue <https://www.mouser.com/datasheet/2/216/APT1608VBC_D-246010.pdf> Green <https://www.mouser.com/datasheet/2/216/APT1608ZGCK-1173388.pdf> Orange <https://www.mouser.com/datasheet/2/216/APT1608SECK-6197.pdf> Red <https://www.mouser.com/datasheet/2/216/APT1608SECK-J3-PRV-1173336.pdf> White <https://www.mouser.com/datasheet/2/50/SM0603UWC-880813.pdf> Yellow <https://www.mouser.com/datasheet/2/216/APT1608SYCK-J3-PRV-1173311.pdf> 2835 (Series not on Digikey) Lumiled LUXEON 2835 Color Line <https://www.mouser.com/datasheet/2/602/DS236_luxeon_2835_color_line_datasheet-1596094.pdf>; COLOR: Green; MANUFACTURER: Lumileds; MOPN: 997-L128GRN10350; MPN: L128-GRN1003500000
D107 = HyTechDevices:LED_?_*: LED 0603 Blue <https://www.mouser.com/datasheet/2/216/APT1608VBC_D-246010.pdf> Green <https://www.mouser.com/datasheet/2/216/APT1608ZGCK-1173388.pdf> Orange <https://www.mouser.com/datasheet/2/216/APT1608SECK-6197.pdf> Red <https://www.mouser.com/datasheet/2/216/APT1608SECK-J3-PRV-1173336.pdf> White <https://www.mouser.com/datasheet/2/50/SM0603UWC-880813.pdf> Yellow <https://www.mouser.com/datasheet/2/216/APT1608SYCK-J3-PRV-1173311.pdf> 2835 (Series not on Digikey) Lumiled LUXEON 2835 Color Line <https://www.mouser.com/datasheet/2/602/DS236_luxeon_2835_color_line_datasheet-1596094.pdf>; COLOR: Blue; MANUFACTURER: Lumileds; MOPN: 997-L128BLU10350; MPN: L128-BLU1003500000
DN1 DN2 = HyTechDevices:TVS_ARRAY_*: TVS Diode Array Datasheet <https://www.mouser.com/datasheet/2/427/vesd05a5-06gtovesd26a5-06g-1768003.pdf>; DKPN: 112-VESD05A5-06G-G3-08CT-ND; MANUFACTURER: Vishay General Semiconductor - Diodes Division; MOPN: 78-VESD05A5-06G-G308; MPN: VESD05A5-06G-G3-08; VOLTAGE: 5V
J1 = HyTechDevices:JUMPER_?_*: 2 Pin Connector; DKPN: 13-RC0603FR-130RLTR-ND; MANUFACTURER: YAGEO; MOPN: 603-RC0603FR-130RL; MPN: RC0603FR-130RL
J2 = HyTechDevices:CONNECTOR-8_?_*: 8 Pin Connector; DKPN: WM1834CT-ND; MANUFACTURER: Molex; MOPN: 538-43045-0811; MPN: 0430450811
J3 = HyTechDevices:CONNECTOR-CAN_?_*: HyTech CAN Connector; DKPN: WM1832CT-ND; MANUFACTURER: Molex; MOPN: 538-43045-0411; MPN: 0430450411
J4 = HyTechDevices:CONNECTOR-6_?_*: 6 Pin Connector; DKPN: WM1833CT-ND; MANUFACTURER: Molex; MOPN: 538-43045-0611; MPN: 0430450611
J5 = HyTechDevices:CONNECTOR-AVR-ISP_?: AVR ISP 6-pin Header Reference <https://en.wikipedia.org/wiki/In-system_programming>; DKPN: S2351E-05-ND; MANUFACTURER: Sullins Connector Solutions; MPN: GBC05DABN-M30
L1 = HyTechDevices:INDUCTOR_?_*: Inductor LQM18DH100M70 Datasheet <https://search.murata.co.jp/Ceramy/image/img/P02/JELF243B-9127.pdf> 74451133 Datasheet <https://www.we-online.com/catalog/datasheet/74451133.pdf> SRU1408 Datasheet <https://www.mouser.com/datasheet/2/54/SRU1048-1391431.pdf>; CURRENT_RATED: 300mA; CURRENT_SATURATION: 100mA; DCR: 1.37Ω; DKPN: 490-LQM18DH100M70LTR-ND; INDUCTANCE: 10µH; MANUFACTURER: Murata Electronics; MOPN: 81-LQM18DH100M70L; MPN: LQM18DH100M70L; TOLERANCE: 20%
LS100 = HyTechDevices:BUZZER_3_PIN_: 3 Pin Buzzer CPT-3011C-120 Datasheet <https://www.cuidevices.com/product/resource/cpt-3011c-120.pdf>; DKPN: 102-3762-ND; FREQUENCY: 3kHz; MANUFACTURER: CUI Devices; MOPN: 490-CPT-3011C-120; MPN: CPT-3011C-120; VOLTAGE: 12V; VOLUME: 85dB
Q1-Q8 = HyTechDevices:TRANSISTOR_N_MOS_?_*: N-MOSFET PMV15ENEA Datasheet <https://www.mouser.com/datasheet/2/916/PMV15ENEA-1604828.pdf> TK6P65W Datasheet <https://www.mouser.com/datasheet/2/408/TK6P65W_datasheet_en_20151225-1916290.pdf> SIR638ADP Datasheet <https://www.mouser.com/datasheet/2/427/sir638adp-1766131.pdf>; DKPN: 1727-8588-1-ND; MANUFACTURER: Nexperia USA Inc.; MOPN: 771-PMV15ENEAR; MPN: PMV15ENEAR
R1 R10 = HyTechDevices:RESISTOR_?_*: Resistor PWR163 Series <https://www.mouser.com/datasheet/2/54/pwr163-777985.pdf> AC Series <https://www.mouser.com/datasheet/2/447/Yageo_PYu_AC_51_RoHS_L_7_1714230-1874691.pdf> PU Series <https://www.mouser.com/datasheet/2/447/PYu-PU_51_RoHS_L_6-1504619.pdf> ERA Series <https://www.mouser.com/datasheet/2/315/AOA0000C307-1149632.pdf> PWR263 Series <https://www.mouser.com/datasheet/2/54/pwr263s_35-778069.pdf> RC Series <https://www.mouser.com/datasheet/2/447/Yageo_03_18_2021_PYu_RC_Group_51_RoHS_L_11-2199992.pdf> ERJ PB3, PB6 Series <https://www.mouser.com/datasheet/2/315/AOA0000C328-1530132.pdf> ERJ PA2, P03, PA3, P06, P08, P14 Series <https://www.mouser.com/datasheet/2/315/AOA0000C331-1141874.pdf>; DKPN: P16066TR-ND; MANUFACTURER: Panasonic Electronic Components; MOPN: 667-ERJ-P06F22R0V; MPN: ERJ-P06F22R0V; POWER: 0.5W; RESISTANCE: 22; TOLERANCE: 1%; VOLTAGE_CONTINUOUS: 3.32V; VOLTAGE_MAX: 400V
R2 R5 R8 R14 R20 R25 = HyTechDevices:RESISTOR_?_*: Resistor PWR163 Series <https://www.mouser.com/datasheet/2/54/pwr163-777985.pdf> AC Series <https://www.mouser.com/datasheet/2/447/Yageo_PYu_AC_51_RoHS_L_7_1714230-1874691.pdf> PU Series <https://www.mouser.com/datasheet/2/447/PYu-PU_51_RoHS_L_6-1504619.pdf> ERA Series <https://www.mouser.com/datasheet/2/315/AOA0000C307-1149632.pdf> PWR263 Series <https://www.mouser.com/datasheet/2/54/pwr263s_35-778069.pdf> RC Series <https://www.mouser.com/datasheet/2/447/Yageo_03_18_2021_PYu_RC_Group_51_RoHS_L_11-2199992.pdf> ERJ PB3, PB6 Series <https://www.mouser.com/datasheet/2/315/AOA0000C328-1530132.pdf> ERJ PA2, P03, PA3, P06, P08, P14 Series <https://www.mouser.com/datasheet/2/315/AOA0000C331-1141874.pdf>; DKPN: 541-15.0STR-ND; MANUFACTURER: Vishay Dale; MOPN: 71-CRCW060315R0FKEAH; MPN: CRCW060315R0FKEAHP; POWER: 0.33W; RESISTANCE: 15; TOLERANCE: 1%; VOLTAGE_CONTINUOUS: 2.22V; VOLTAGE_MAX: 75V
R3 R11 R12 = HyTechDevices:RESISTOR_?_*: Resistor PWR163 Series <https://www.mouser.com/datasheet/2/54/pwr163-777985.pdf> AC Series <https://www.mouser.com/datasheet/2/447/Yageo_PYu_AC_51_RoHS_L_7_1714230-1874691.pdf> PU Series <https://www.mouser.com/datasheet/2/447/PYu-PU_51_RoHS_L_6-1504619.pdf> ERA Series <https://www.mouser.com/datasheet/2/315/AOA0000C307-1149632.pdf> PWR263 Series <https://www.mouser.com/datasheet/2/54/pwr263s_35-778069.pdf> RC Series <https://www.mouser.com/datasheet/2/447/Yageo_03_18_2021_PYu_RC_Group_51_RoHS_L_11-2199992.pdf> ERJ PB3, PB6 Series <https://www.mouser.com/datasheet/2/315/AOA0000C328-1530132.pdf> ERJ PA2, P03, PA3, P06, P08, P14 Series <https://www.mouser.com/datasheet/2/315/AOA0000C331-1141874.pdf>; DKPN: 311-10.0KHRCT-ND; MANUFACTURER: Yageo; MOPN: 603-RC0603FR-0710KL; MPN: RC0603FR-0710KL; POWER: 0.1W; RESISTANCE: 10k; TOLERANCE: 1%; VOLTAGE_CONTINUOUS: 31.62V; VOLTAGE_MAX: 75V
R4 R7 = HyTechDevices:RESISTOR_?_*: Resistor PWR163 Series <https://www.mouser.com/datasheet/2/54/pwr163-777985.pdf> AC Series <https://www.mouser.com/datasheet/2/447/Yageo_PYu_AC_51_RoHS_L_7_1714230-1874691.pdf> PU Series <https://www.mouser.com/datasheet/2/447/PYu-PU_51_RoHS_L_6-1504619.pdf> ERA Series <https://www.mouser.com/datasheet/2/315/AOA0000C307-1149632.pdf> PWR263 Series <https://www.mouser.com/datasheet/2/54/pwr263s_35-778069.pdf> RC Series <https://www.mouser.com/datasheet/2/447/Yageo_03_18_2021_PYu_RC_Group_51_RoHS_L_11-2199992.pdf> ERJ PB3, PB6 Series <https://www.mouser.com/datasheet/2/315/AOA0000C328-1530132.pdf> ERJ PA2, P03, PA3, P06, P08, P14 Series <https://www.mouser.com/datasheet/2/315/AOA0000C331-1141874.pdf>; DKPN: 311-60.4HRCT-ND; MANUFACTURER: Yageo; MOPN: 603-RC0603FR-0760R4L; MPN: RC0603FR-0760R4L; POWER: 0.1W; RESISTANCE: 60.4; TOLERANCE: 1%; VOLTAGE_CONTINUOUS: 2.48V; VOLTAGE_MAX: 75V
R6 = HyTechDevices:RESISTOR_?_*: Resistor PWR163 Series <https://www.mouser.com/datasheet/2/54/pwr163-777985.pdf> AC Series <https://www.mouser.com/datasheet/2/447/Yageo_PYu_AC_51_RoHS_L_7_1714230-1874691.pdf> PU Series <https://www.mouser.com/datasheet/2/447/PYu-PU_51_RoHS_L_6-1504619.pdf> ERA Series <https://www.mouser.com/datasheet/2/315/AOA0000C307-1149632.pdf> PWR263 Series <https://www.mouser.com/datasheet/2/54/pwr263s_35-778069.pdf> RC Series <https://www.mouser.com/datasheet/2/447/Yageo_03_18_2021_PYu_RC_Group_51_RoHS_L_11-2199992.pdf> ERJ PB3, PB6 Series <https://www.mouser.com/datasheet/2/315/AOA0000C328-1530132.pdf> ERJ PA2, P03, PA3, P06, P08, P14 Series <https://www.mouser.com/datasheet/2/315/AOA0000C331-1141874.pdf>; DKPN: 13-RT0805BRD072K18LTR-ND; MANUFACTURER: YAGEO; MOPN: 603-RT0805BRD072K18L; MPN: RT0805BRD072K18L; POWER: 0.125W; RESISTANCE: 2.18k; TOLERANCE: 0.1%; VOLTAGE_CONTINUOUS: 16.51V; VOLTAGE_MAX: 150V
R9 = HyTechDevices:RESISTOR_?_*: Resistor PWR163 Series <https://www.mouser.com/datasheet/2/54/pwr163-777985.pdf> AC Series <https://www.mouser.com/datasheet/2/447/Yageo_PYu_AC_51_RoHS_L_7_1714230-1874691.pdf> PU Series <https://www.mouser.com/datasheet/2/447/PYu-PU_51_RoHS_L_6-1504619.pdf> ERA Series <https://www.mouser.com/datasheet/2/315/AOA0000C307-1149632.pdf> PWR263 Series <https://www.mouser.com/datasheet/2/54/pwr263s_35-778069.pdf> RC Series <https://www.mouser.com/datasheet/2/447/Yageo_03_18_2021_PYu_RC_Group_51_RoHS_L_11-2199992.pdf> ERJ PB3, PB6 Series <https://www.mouser.com/datasheet/2/315/AOA0000C328-1530132.pdf> ERJ PA2, P03, PA3, P06, P08, P14 Series <https://www.mouser.com/datasheet/2/315/AOA0000C331-1141874.pdf>; DKPN: P150KDBCT-ND; MANUFACTURER: Panasonic Electronic Components; MOPN: 667-ERA-3AEB154V; MPN: ERA-3AEB154V; POWER: 0.1W; RESISTANCE: 150k; TOLERANCE: 1%; VOLTAGE_CONTINUOUS: 75V; VOLTAGE_MAX: 75V
R13 = HyTechDevices:RESISTOR_?_*: Resistor PWR163 Series <https://www.mouser.com/datasheet/2/54/pwr163-777985.pdf> AC Series <https://www.mouser.com/datasheet/2/447/Yageo_PYu_AC_51_RoHS_L_7_1714230-1874691.pdf> PU Series <https://www.mouser.com/datasheet/2/447/PYu-PU_51_RoHS_L_6-1504619.pdf> ERA Series <https://www.mouser.com/datasheet/2/315/AOA0000C307-1149632.pdf> PWR263 Series <https://www.mouser.com/datasheet/2/54/pwr263s_35-778069.pdf> RC Series <https://www.mouser.com/datasheet/2/447/Yageo_03_18_2021_PYu_RC_Group_51_RoHS_L_11-2199992.pdf> ERJ PB3, PB6 Series <https://www.mouser.com/datasheet/2/315/AOA0000C328-1530132.pdf> ERJ PA2, P03, PA3, P06, P08, P14 Series <https://www.mouser.com/datasheet/2/315/AOA0000C331-1141874.pdf>; DKPN: 311-1.50MHRCT-ND; MANUFACTURER: Yageo; MOPN: 603-RC0603FR-071M5L; MPN: RC0603FR-071M5L; POWER: 0.1W; RESISTANCE: 1.5M; TOLERANCE: 1%; VOLTAGE_CONTINUOUS: 75V; VOLTAGE_MAX: 75V
R15 = HyTechDevices:RESISTOR_?_*: Resistor PWR163 Series <https://www.mouser.com/datasheet/2/54/pwr163-777985.pdf> AC Series <https://www.mouser.com/datasheet/2/447/Yageo_PYu_AC_51_RoHS_L_7_1714230-1874691.pdf> PU Series <https://www.mouser.com/datasheet/2/447/PYu-PU_51_RoHS_L_6-1504619.pdf> ERA Series <https://www.mouser.com/datasheet/2/315/AOA0000C307-1149632.pdf> PWR263 Series <https://www.mouser.com/datasheet/2/54/pwr263s_35-778069.pdf> RC Series <https://www.mouser.com/datasheet/2/447/Yageo_03_18_2021_PYu_RC_Group_51_RoHS_L_11-2199992.pdf> ERJ PB3, PB6 Series <https://www.mouser.com/datasheet/2/315/AOA0000C328-1530132.pdf> ERJ PA2, P03, PA3, P06, P08, P14 Series <https://www.mouser.com/datasheet/2/315/AOA0000C331-1141874.pdf>; DKPN: 311-100HRCT-ND; MANUFACTURER: Yageo; MOPN: 603-RC0603FR-07100RL; MPN: RC0603FR-07100RL; POWER: 0.1W; RESISTANCE: 100; TOLERANCE: 1%; VOLTAGE_CONTINUOUS: 3.16V; VOLTAGE_MAX: 75V
R16-R19 = HyTechDevices:RESISTOR_?_*: Resistor PWR163 Series <https://www.mouser.com/datasheet/2/54/pwr163-777985.pdf> AC Series <https://www.mouser.com/datasheet/2/447/Yageo_PYu_AC_51_RoHS_L_7_1714230-1874691.pdf> PU Series <https://www.mouser.com/datasheet/2/447/PYu-PU_51_RoHS_L_6-1504619.pdf> ERA Series <https://www.mouser.com/datasheet/2/315/AOA0000C307-1149632.pdf> PWR263 Series <https://www.mouser.com/datasheet/2/54/pwr263s_35-778069.pdf> RC Series <https://www.mouser.com/datasheet/2/447/Yageo_03_18_2021_PYu_RC_Group_51_RoHS_L_11-2199992.pdf> ERJ PB3, PB6 Series <https://www.mouser.com/datasheet/2/315/AOA0000C328-1530132.pdf> ERJ PA2, P03, PA3, P06, P08, P14 Series <https://www.mouser.com/datasheet/2/315/AOA0000C331-1141874.pdf>; DKPN: 311-43.0KHRCT-ND; MANUFACTURER: Yageo; MOPN: 603-RC0603FR-0743KL; MPN: RC0603FR-0743KL; POWER: 0.1W; RESISTANCE: 43k; TOLERANCE: 1%; VOLTAGE_CONTINUOUS: 65.57V; VOLTAGE_MAX: 75V
R21-R24 = HyTechDevices:RESISTOR_?_*: Resistor PWR163 Series <https://www.mouser.com/datasheet/2/54/pwr163-777985.pdf> AC Series <https://www.mouser.com/datasheet/2/447/Yageo_PYu_AC_51_RoHS_L_7_1714230-1874691.pdf> PU Series <https://www.mouser.com/datasheet/2/447/PYu-PU_51_RoHS_L_6-1504619.pdf> ERA Series <https://www.mouser.com/datasheet/2/315/AOA0000C307-1149632.pdf> PWR263 Series <https://www.mouser.com/datasheet/2/54/pwr263s_35-778069.pdf> RC Series <https://www.mouser.com/datasheet/2/447/Yageo_03_18_2021_PYu_RC_Group_51_RoHS_L_11-2199992.pdf> ERJ PB3, PB6 Series <https://www.mouser.com/datasheet/2/315/AOA0000C328-1530132.pdf> ERJ PA2, P03, PA3, P06, P08, P14 Series <https://www.mouser.com/datasheet/2/315/AOA0000C331-1141874.pdf>; DKPN: P30KBDCT-ND; MANUFACTURER: Panasonic Electronic Components; MOPN: 667-ERA-3ARB303V; MPN: ERA-3ARB303V; POWER: 0.1W; RESISTANCE: 30k; TOLERANCE: 0.1%; VOLTAGE_CONTINUOUS: 54.77V; VOLTAGE_MAX: 75V
RN1 RN6 = HyTechDevices:RESISTOR_NETWORK_4_*: Resistor Network, 4 Elements YC/TC Series <https://www.mouser.com/datasheet/2/447/yageo_yago_s_a0009164376_1-1991537.pdf> CAT/CAY 16 Series <https://www.mouser.com/datasheet/2/54/CATCAY-777361.pdf>; DKPN: CAT16-100J4LFCT-ND; MANUFACTURER: Bourns Inc.; MOPN: 652-CAT16-100J4LF; MPN: CAT16-100J4LF; POWER: 1/16W; RESISTANCE: 10; TOLERANCE: 5%; VOLTAGE: 50V
RN2 RN4 = HyTechDevices:RESISTOR_NETWORK_4_*: Resistor Network, 4 Elements YC/TC Series <https://www.mouser.com/datasheet/2/447/yageo_yago_s_a0009164376_1-1991537.pdf> CAT/CAY 16 Series <https://www.mouser.com/datasheet/2/54/CATCAY-777361.pdf>; DKPN: YC164J-160CT-ND; MANUFACTURER: Yageo; MOPN: 603-YC164-JR-07160RL; MPN: YC164-JR-07160RL; POWER: 1/16W; RESISTANCE: 160; TOLERANCE: 5%; VOLTAGE: 50V
RN3 = HyTechDevices:RESISTOR_NETWORK_4_*: Resistor Network, 4 Elements YC/TC Series <https://www.mouser.com/datasheet/2/447/yageo_yago_s_a0009164376_1-1991537.pdf> CAT/CAY 16 Series <https://www.mouser.com/datasheet/2/54/CATCAY-777361.pdf>; DKPN: 13-YC164-FR-071KLCT-ND; MANUFACTURER: Yageo; MOPN: 603-YC164-FR-071KL; MPN: YC164-FR-071KL; POWER: 1/16W; RESISTANCE: 1k; TOLERANCE: 1%; VOLTAGE: 50V
RN5 RN7 = HyTechDevices:RESISTOR_NETWORK_4_*: Resistor Network, 4 Elements YC/TC Series <https://www.mouser.com/datasheet/2/447/yageo_yago_s_a0009164376_1-1991537.pdf> CAT/CAY 16 Series <https://www.mouser.com/datasheet/2/54/CATCAY-777361.pdf>; DKPN: YAG3410CT-ND; MANUFACTURER: Yageo; MOPN: 603-TC164-FR-0710KL; MPN: TC164-FR-0710KL; POWER: 1/16W; RESISTANCE: 10K; TOLERANCE: 1%; VOLTAGE: 50V
TP1 = HyTechDevices:TEST_POINT: Test Point for Probing; DKPN: 36-5015CT-ND; MANUFACTURER: Keystone Electronics; MOPN: 534-5015; MPN: 5015; SIGNAL: +5V
TP2 = HyTechDevices:TEST_POINT: Test Point for Probing; DKPN: 36-5015CT-ND; MANUFACTURER: Keystone Electronics; MOPN: 534-5015; MPN: 5015; SIGNAL: SHUTDOWN_F
TP3 = HyTechDevices:TEST_POINT: Test Point for Probing; DKPN: 36-5015CT-ND; MANUFACTURER: Keystone Electronics; MOPN: 534-5015; MPN: 5015; SIGNAL: +12V
TP4 = HyTechDevices:TEST_POINT: Test Point for Probing; DKPN: 36-5015CT-ND; MANUFACTURER: Keystone Electronics; MOPN: 534-5015; MPN: 5015; SIGNAL: SHUTDOWN_G
TP5 = HyTechDevices:TEST_POINT: Test Point for Probing; DKPN: 36-5015CT-ND; MANUFACTURER: Keystone Electronics; MOPN: 534-5015; MPN: 5015; SIGNAL: GND
TP6 = HyTechDevices:TEST_POINT: Test Point for Probing; DKPN: 36-5015CT-ND; MANUFACTURER: Keystone Electronics; MOPN: 534-5015; MPN: 5015; SIGNAL: SHUTDOWN_H
TP7 = HyTechDevices:TEST_POINT: Test Point for Probing; DKPN: 36-5015CT-ND; MANUFACTURER: Keystone Electronics; MOPN: 534-5015; MPN: 5015
U1 = HyTechDevices:MCP2515: MCP2515 Can Controller Datasheet <https://www.mouser.com/datasheet/2/268/MCP2515-Stand-Alone-CAN-Controller-with-SPI-200018-708845.pdf>; DKPN: MCP2515-E/ST-ND; MANUFACTURER: Microchip Technology; MOPN: 579-MCP2515-E/ST; MPN: MCP2515-E/ST
U2 = HyTechDevices:MCP2562FD: MCP2562FD Can Tranciever Datasheet <https://ww1.microchip.com/downloads/en/DeviceDoc/20005284A.pdf>; ALT_DKPN: MCP2562-E/SN-ND; ALT_MANUFACTURER: Microchip Technology; ALT_MOPN: 579-MCP2562-E/SN; ALT_MPN: MCP2562-E/SN; DKPN: MCP2562FD-E/SN-ND; MANUFACTURER: Microchip Technology; MOPN: 579-MCP2562FD-E/SN; MPN: MCP2562FD-E/SN
U3 = HyTechDevices:MCP23S08: IO Expander 8 Channel Datasheet <https://ww1.microchip.com/downloads/en/DeviceDoc/MCP23008-MCP23S08-Data-Sheet-20001919F.pdf>; DKPN: MCP23S08-E/SS-ND; MANUFACTURER: Microchip Technology; MOPN: 579-MCP23S08-E/SS; MPN: MCP23S08-E/SS
U4 U6 = HyTechDevices:LOGICGATE_INVERTER_: Inverter SN74LVC Datasheet <https://www.ti.com/lit/ds/symlink/sn74lvc1g04.pdf>; DKPN: 296-SN74LVC1G04DCK3TR-ND; MANUFACTURER: Texas Instruments; MOPN: 595-SN74LVC1G04DCK3; MPN: SN74LVC1G04DCK3
U5 = HyTechDevices:RE46C100: RE46C100 Piezoelectric Horn Driver IC Datasheet <https://ww1.microchip.com/downloads/en/DeviceDoc/20002166B.pdf>; DKPN: RE46C100S8TFTR-ND; MANUFACTURER: Microchip Technology; MOPN: 579-RE46C100S8TF; MPN: RE46C100S8TF
U7 = HyTechDevices:ATMEGA328P-AU: ATmega328P Datasheet <https://www.mouser.com/datasheet/2/268/ATmega48A_PA_88A_PA_168A_PA_328_P_DS_DS40002061B-1900559.pdf>; DKPN: ATMEGA328P-AURCT-ND; MANUFACTURER: Microchip Technology; MOPN: 556-ATMEGA328P-AU; MPN: ATMEGA328P-AU
X1 X2 = HyTechDevices:CRYSTAL_*: Crystal Datasheet <https://www.mouser.com/datasheet/2/122/ECX_42-12562.pdf> Recommended load capacitor for the ECS-160-10-42-CKM-TR: VJ0603A150FXQPW1BC <https://www.mouser.com/datasheet/2/427/vjw1bcbascomseries-1762447.pdf>; DKPN: XC2566CT-ND; FREQUENCY: 16 MHz; LOAD_CAPACITANCE: 10pF; MANUFACTURER: TXC CORPORATION; MOPN: 520-160-10-42-CKMT; MPN: ECS-160-10-42-CKM-TR; SHUNT_CAPACITANCE: 2 - 5 pF
XF1 = HyTechDevices:FUSE_HOLDER_*: Fuse Holder All PNs for the holder; if Miniblade Fuses <https://www.littelfuse.com/media?resourcetype=datasheets&itemid=0f5f58cb-559e-494b-8d53-723f30445ae5&filename=littelfuse-mini-datasheet> needed, order separately. Mini-Blade PTH <https://www.mouser.com/datasheet/2/215/3568-742601.pdf> Mini-Blade SMD <https://www.mouser.com/datasheet/2/215/588-744913.pdf>; DKPN: 36-3588-ND; FUSE_TYPE: MINI 297; MANUFACTURER: Keystone Electronics; MOPN: 534-3588; MPN: 3588

## Board
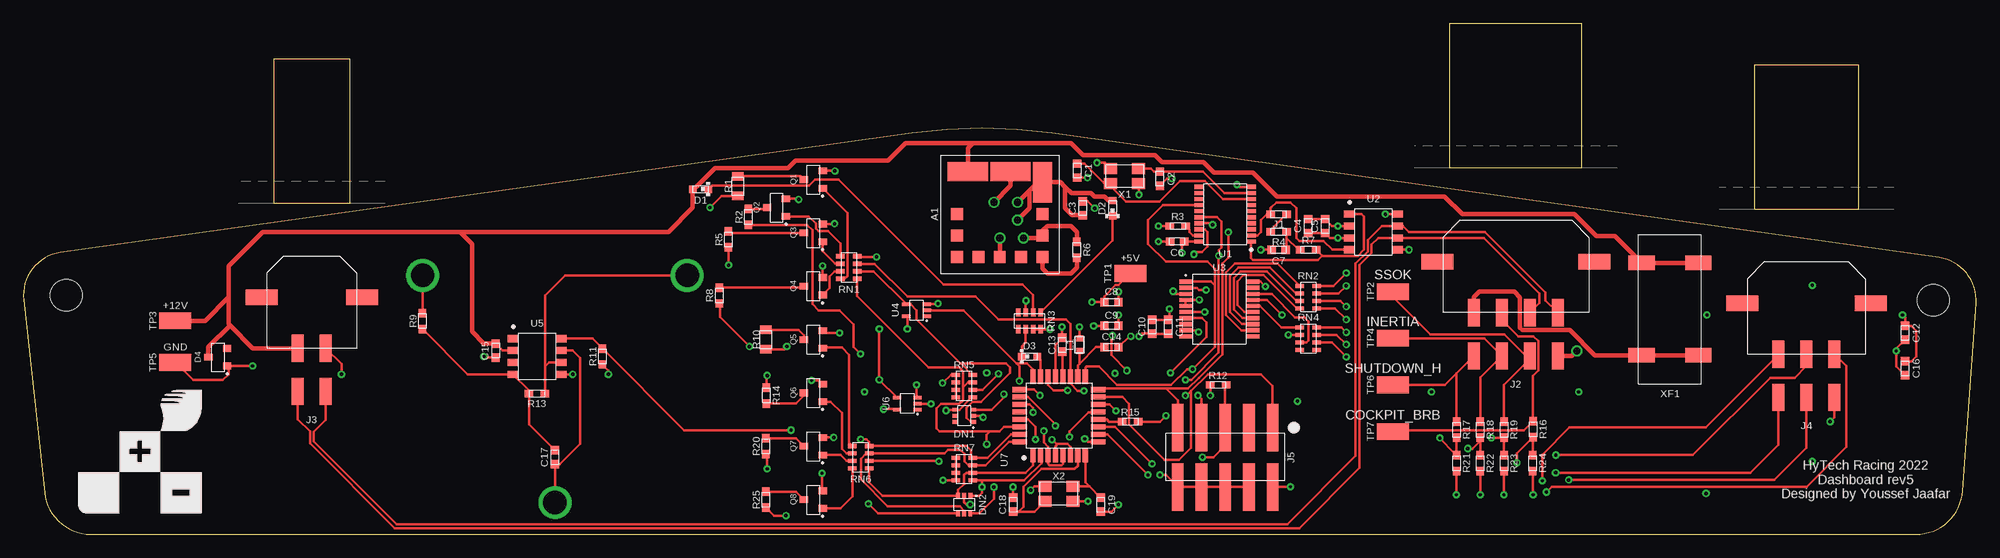
[diagram p4: board, top side]
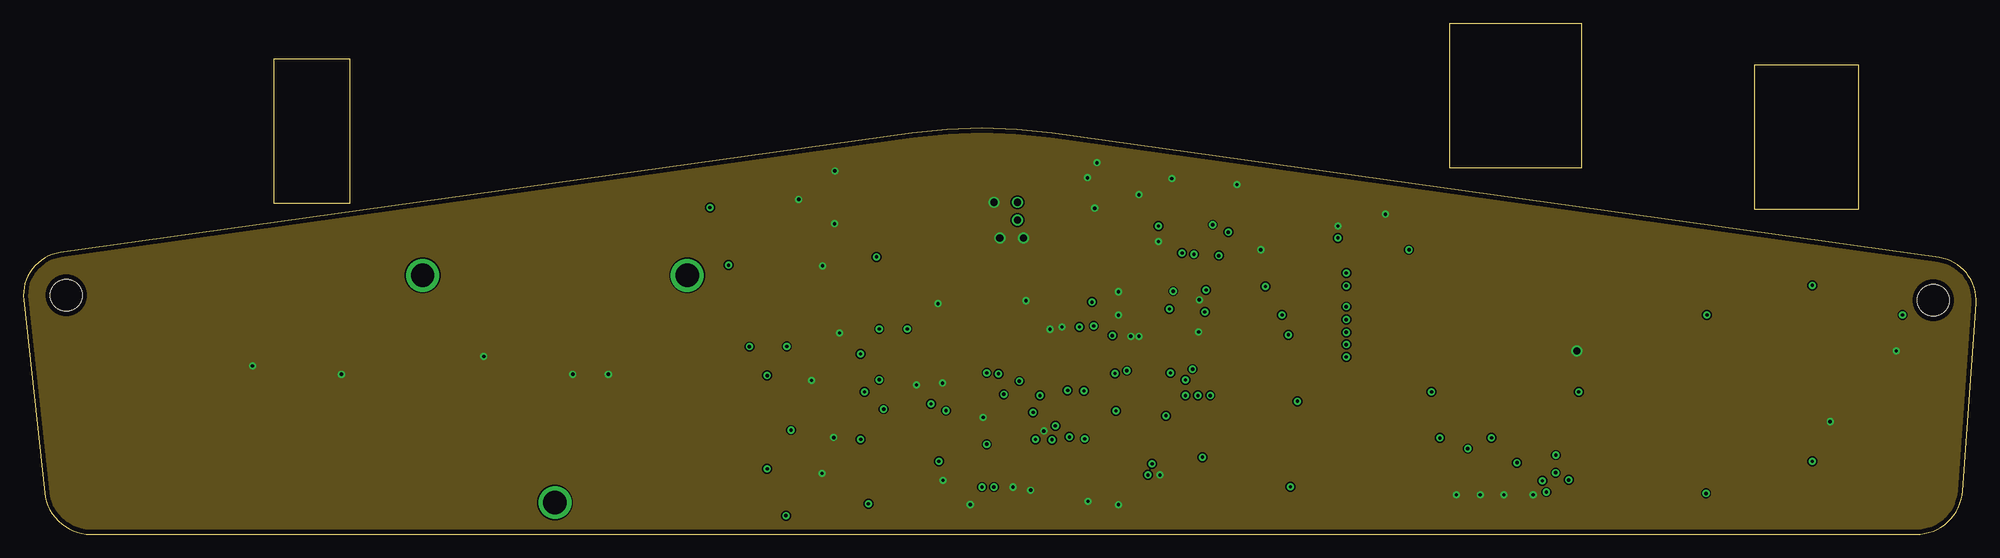
[diagram p5: board, inner layer Route2]
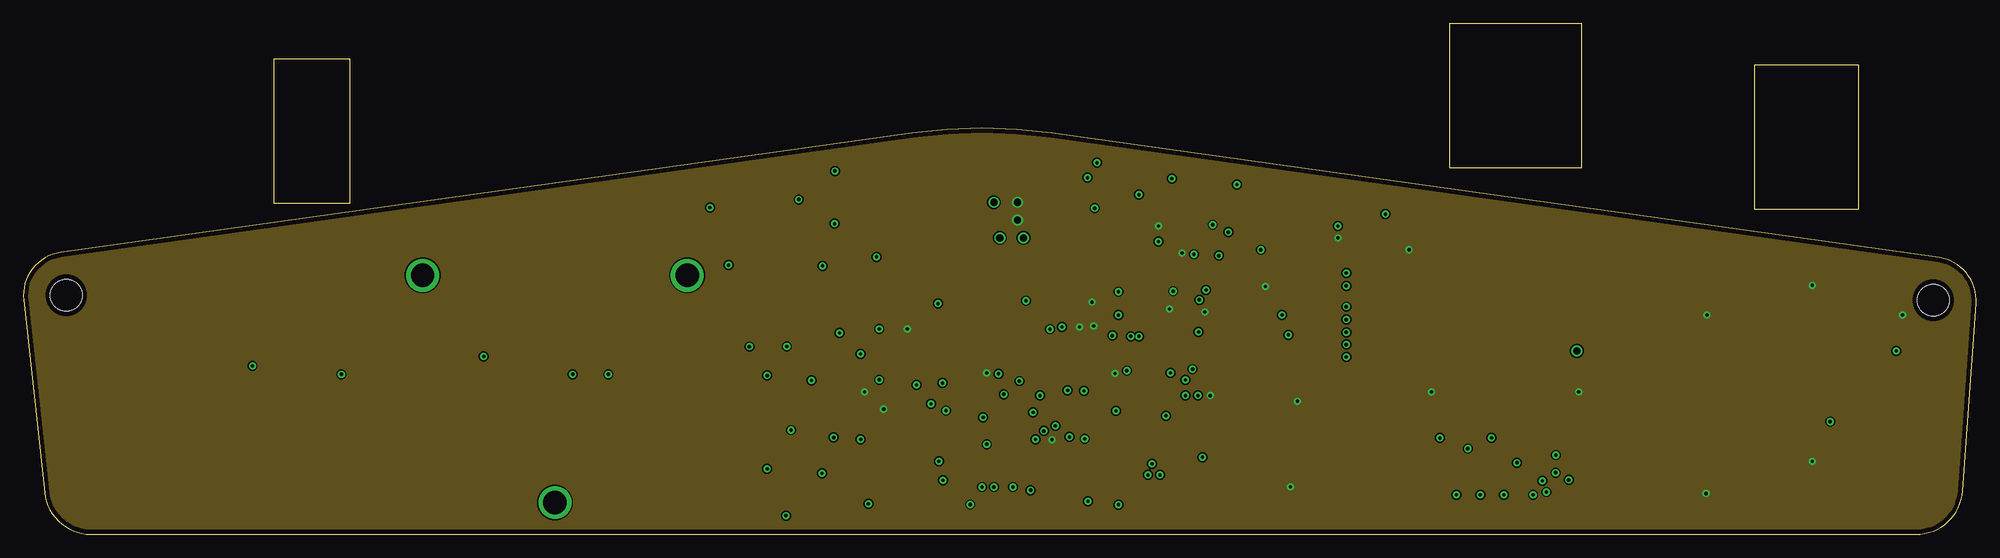
[diagram p6: board, inner layer Route15]
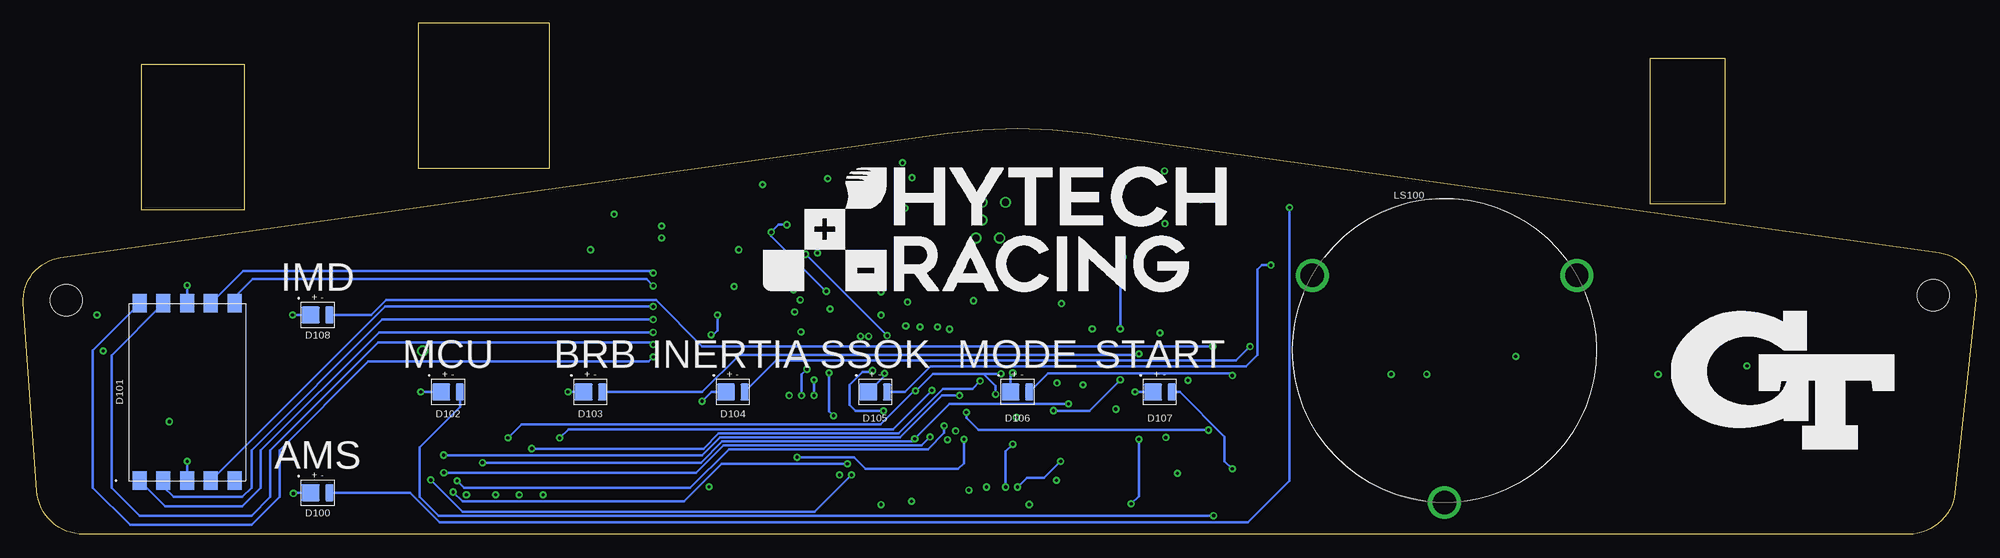
[diagram p7: board, bottom side, seen from below]

Size 209.07 x 43.5 mm. Coordinates in mm from the lower left corner, seen from the top.
Outline: 3.96,30.16 arc88 0.03,25.11 2.27,4.46 arc84 7.24,0 202.64,0 arc86 207.62,4.64 209.06,24.74 arc86 205.11,29.63 110.14,42.98 arc16 95.14,42.98 3.96,30.16
Copper layers (1+2*15+16): Top 0.035mm / dielectric 0.2mm / Route2 0.0175mm / dielectric 1.065mm / Route15 0.0175mm / dielectric 0.2mm / Bottom 0.035mm
Design rules "HyTech Default (4 Layer)": minimum track width 6mil, minimum drill 10mil, track to track 6mil, track to pad 6mil, pad to pad 6mil, via to via 20mil, smd to smd 6mil, copper to edge 20mil, drill to drill 21mil, minimum pad ring 8mil, minimum via ring 8mil, stop-mask expansion 3mil, vias tented up to drill 30mil, thermal gap 10mil

### Footprints (pad centres in the part's own frame; a part is rotated, then mirrored left to right if it is on the bottom)
OKL-T/1-W12 = smd 1.27 x 1.27: 1 -4.572,0; 5 4.572,0; 6 4.572,-4.572; 7 0,-4.572; 8 -2.286,-4.572; 9 -4.572,-4.572; 10 -4.572,-2.286; 11 4.572,-2.286; 12 2.286,-4.572 | smd 4.318 x 2.032: 2 -3.429,4.572; 3 1.143,4.572 | smd 2.032 x 4.318: 4 4.572,3.429
0603-CAP = smd 0.9 x 0.9: 1 -0.75,0; 2 0.75,0
0603-LED = smd 0.8 x 0.8: 1 -0.825,0; 2 0.825,0
SOT-23 = smd 0.711 x 0.889: 1 -0.94,-1.003; 2 0.94,-1.003; 3 0,1.003
2835-LED = smd 1.93 x 1.8: A -0.735,0 | smd 0.87 x 1.8: C 1.265,0
DSM7T = smd 1.5 x 2: 1 -5.08,-9.5; 2 -2.54,-9.5; 3 0,-9.5; 4 2.54,-9.5; 5 5.08,-9.5; 6 5.08,9.5; 7 2.54,9.5; 8 0,9.5; 9 -2.54,9.5; 10 -5.08,9.5
SOT-363 = smd 0.42 x 0.6: 1 -0.673,-0.95; 2 0,-0.95; 3 0.65,-0.95; 4 0.65,0.95; 5 0,0.95; 6 -0.65,0.95
0603-RES = smd 0.9 x 0.8: 1 -0.85,0; 2 0.85,0
MOLEX_MICROFIT_SMD_RIGHTANGLE_08_DUAL = smd 1.27 x 2.921: 1 4.5,5.474; 2 1.5,5.474; 3 -1.5,5.474; 4 -4.5,5.474; 5 4.5,10.097; 6 1.5,10.097; 7 -1.5,10.097; 8 -4.5,10.097 | smd 3.429 x 1.651: PAD1 8.386,0; PAD2 -8.386,0
MOLEX_MICROFIT_SMD_RIGHTANGLE_04_DUAL = smd 1.27 x 2.921: 1 1.5,5.474; 2 -1.5,5.474; 3 1.5,10.097; 4 -1.5,10.097 | smd 3.429 x 1.651: PAD1 5.386,0; PAD2 -5.386,0
MOLEX_MICROFIT_SMD_RIGHTANGLE_06_DUAL = smd 1.27 x 2.921: 1 3,5.474; 2 0,5.474; 3 -3,5.474; 4 3,10.097; 5 0,10.097; 6 -3,10.097 | smd 3.429 x 1.651: PAD1 6.886,0; PAD2 -6.886,0
2X05_SMD = smd 1.27 x 5.08: 1 -5.08,-3.175; 2 -5.08,3.175; 3 -2.54,-3.175; 4 -2.54,3.175; 5 0,-3.175; 6 0,3.175; 7 2.54,-3.175; 8 2.54,3.175; 9 5.08,-3.175; 10 5.08,3.175
0603-IND = smd 0.65 x 0.7: 1 -0.675,0; 2 0.675,0
CPT-3011C-120 = drill 2.5: F 14.162,8.051; G -14.162,8.051; M 0,-16.29
0805-RES = smd 0.9 x 1.2: 1 -1.05,0; 2 1.05,0
1206-RES-ARRAY = smd 0.45 x 0.9: 1 -1.2,-0.9; 2 -0.4,-0.9; 3 0.4,-0.9; 4 1.2,-0.9; 5 1.2,0.9; 6 0.4,0.9; 7 -0.4,0.9; 8 -1.2,0.9
5015 = smd 3.429 x 1.778: 1 0,0
TSSOP-20 = smd 0.45 x 1.05: 1 -2.925,-2.775; 2 -2.275,-2.775; 3 -1.625,-2.775; 4 -0.975,-2.775; 5 -0.325,-2.775; 6 0.325,-2.775; 7 0.975,-2.775; 8 1.625,-2.775; 9 2.275,-2.775; 10 2.925,-2.775; 11 2.925,2.775; 12 2.275,2.775; 13 1.625,2.775; 14 0.975,2.775; 15 0.325,2.775; 16 -0.325,2.775; 17 -0.975,2.775; 18 -1.625,2.775; 19 -2.275,2.775; 20 -2.925,2.775
SOIC-08(NARROW,0.15") = smd 0.762 x 1.143: 1 -1.905,-2.603; 2 -0.635,-2.603; 3 0.635,-2.603; 4 1.905,-2.603; 5 1.905,2.603; 6 0.635,2.603; 7 -0.635,2.603; 8 -1.905,2.603
SSOP-20 = smd 0.45 x 1.37: 1 -2.925,-3.6; 2 -2.275,-3.6; 3 -1.625,-3.6; 4 -0.975,-3.6; 5 -0.325,-3.6; 6 0.325,-3.6; 7 0.975,-3.6; 8 1.625,-3.6; 9 2.275,-3.6; 10 2.925,-3.6; 11 2.925,3.6; 12 2.275,3.6; 13 1.625,3.6; 14 0.975,3.6; 15 0.325,3.6; 16 -0.325,3.6; 17 -0.975,3.6; 18 -1.625,3.6; 19 -2.275,3.6; 20 -2.925,3.6
SC-70-5 = smd 0.4 x 0.9: 1 -0.65,-1.1; 2 0,-1.1; 3 0.65,-1.1; 4 0.65,1.1; 5 -0.65,1.1
TQFP-32 = smd 1.55 x 0.55: 1 -4.2,2.8; 2 -4.2,2; 3 -4.2,1.2; 4 -4.2,0.4; 5 -4.2,-0.4; 6 -4.2,-1.2; 7 -4.2,-2; 8 -4.2,-2.8; 17 4.2,-2.8; 18 4.2,-2; 19 4.2,-1.2; 20 4.2,-0.4; 21 4.2,0.4; 22 4.2,1.2; 23 4.2,2; 24 4.2,2.8 | smd 0.55 x 1.55: 9 -2.8,-4.2; 10 -2,-4.2; 11 -1.2,-4.2; 12 -0.4,-4.2; 13 0.4,-4.2; 14 1.2,-4.2; 15 2,-4.2; 16 2.8,-4.2; 25 2.8,4.2; 26 2,4.2; 27 1.2,4.2; 28 0.4,4.2; 29 -0.4,4.2; 30 -1.2,4.2; 31 -2,4.2; 32 -2.8,4.2
MOUNTING_M3 = hole 3.4: 0,0
ECX-42 = smd 1.4 x 1.15: 1 -1.5,-0.8; 2 1.5,-0.8; 3 1.5,0.8; 4 -1.5,0.8
3588 = smd 1.575 x 2.819: 1 -4.953,3.035; 2 -4.953,-3.035; 3 4.953,-3.035; 4 4.953,3.035

### Placement (x,y rotation side)
A1  104.54,34.29 0 top
C1  112.85,38.96 270 top
C2  121.69,38.1 270 top
C3  113.43,34.92 90 top
C4  137.56,33.02 90 top
C5  139.36,33.02 90 top
C6  123.52,31.37 180 top
C7  134.39,30.48 180 top
C8  116.49,24.87 0 top
C9  116.49,22.33 0 top
C10  120.87,22.25 270 top
C11  122.57,22.23 270 top
C12  201.47,21.59 270 top
C13  111.25,20.29 90 top
C14  116.49,20.04 0 top
C15  50.57,19.68 90 top
C16  201.47,17.78 270 top
C17  56.92,8.26 90 top
C18  105.96,3.17 90 top
C19  115.34,3.17 270 top
D1  72.49,36.97 180 top
D2  116.61,34.92 90 top
D3  107.72,19.05 0 top
D4  20.82,18.97 90 top
D100  177.57,4.45 0 bottom
D101  191.54,15.24 0 bottom
D102  163.6,15.24 0 bottom
D103  148.36,15.24 0 bottom
D104  133.12,15.24 0 bottom
D105  117.88,15.24 0 bottom
D106  102.64,15.24 0 bottom
D107  87.4,15.24 0 bottom
D108  177.57,23.5 0 bottom
DN1  100.73,12.7 90 top
DN2  100.73,3.17 180 top
J1  134.39,34.29 180 top
J2  159.79,29.21 180 top
J3  30.88,25.4 180 top
J4  190.9,24.77 180 top
J5  128.67,8.26 180 top
L1  113.07,20.29 90 top
LS100  56.92,19.68 0 bottom
Q1  84.57,38.01 90 top
Q2  80.64,35 90 top
Q3  84.57,32.29 90 top
Q4  84.57,26.57 90 top
Q5  84.57,20.86 90 top
Q6  84.57,15.14 90 top
Q7  84.57,9.43 90 top
Q8  84.57,3.71 90 top
R1  76.49,37.29 90 top
R2  77.64,34 90 top
R3  123.59,33.02 0 top
R4  134.39,32.38 180 top
R5  75.49,31.59 90 top
R6  112.8,30.48 270 top
R7  137.56,30.48 0 top
R8  74.49,25.57 90 top
R9  42.74,22.83 90 top
R10  79.49,20.86 90 top
R11  62,19.05 90 top
R12  127.91,16 0 top
R13  54.99,15.06 180 top
R14  79.54,14.86 270 top
R15  118.51,12.06 0 top
R16  161.64,11.25 270 top
R17  153.44,11.2 270 top
R18  155.98,11.2 270 top
R19  158.52,11.2 270 top
R20  79.49,9.43 90 top
R21  153.44,7.62 270 top
R22  155.98,7.62 270 top
R23  158.52,7.62 270 top
R24  161.59,7.62 270 top
R25  79.49,3.71 90 top
RN1  88.38,28.57 90 top
RN2  137.56,25.4 270 top
RN3  107.72,22.86 180 top
RN4  137.56,20.95 270 top
RN5  100.73,15.88 270 top
RN6  89.65,8.26 90 top
RN7  100.73,6.99 270 top
TP1  118.51,27.94 0 top
TP2  146.64,26 0 top
TP3  16.28,22.86 0 top
TP4  146.64,21 0 top
TP5  16.28,18.41 0 top
TP6  146.64,16 0 top
TP7  146.64,11 0 top
U1  128.67,34.29 90 top
U2  144.55,32.38 270 top
U3  128.04,24.13 270 top
U4  95.64,24 90 top
U5  55.01,19.05 270 top
U6  94.64,14 90 top
U7  110.89,12.7 90 top
U$1  [MOUNTING_M3]  4.6,25.61 0 top
U$2  [MOUNTING_M3]  204.47,25.07 0 top
U$3  [LOGO_HYTECH_SQUARE_EXTRA_LARGE]  12.47,8.89 0 top
U$100  [LOGO_GT_LARGE]  20.72,16.51 0 bottom
U$101  [LOGO_HYTECH_LARGE]  129.94,26.04 0 bottom
X1  117.9,38.38 180 top
X2  110.87,4.34 0 top
XF1  176.3,24.13 90 top

### Tracks (layer width: path | path; a pad name or v marks a point on that pad's centre or on a via)
+5V  (via drill 0.35, 0.76)
  Top 0.254: C4.1 C5.1 139.88,31.75 v140.74,31.75 U2.3 | C16.1 202.1,18.53 202.64,19.06 202.64,21.81 202.1,22.34 C12.1 201.47,23.22 v201.19,23.5 | J5.2 v135.66,5.08 | v114.42,24.87 C8.1 115.74,25.49 116.95,26.69 117.26,26.69 TP1.1 | C9.1 v114.6,22.33 | L1.2 v113.07,22.2 | U7.4 110.49,9.43 110.74,9.68 | 110.74,9.68 111.8,9.68 112.09,9.39 U7.6 | 110.74,9.68 110.59,9.68 v110.13,10.13 | v122.7,24.13 122.7,23.1 C11.1 120.9,22.98 C10.1 | U3.20 132.47,27.05 v132.99,26.54 | U3.6 126.47,23.8 v126.49,23.82 | U1.20 C6.1 124.06,31.16 v124.06,30.14 | R3.1 v121.53,33.02 | U2.5 v148.36,30.48 | R12.1 127.07,15.99 v127.07,14.86 | U4.5 94.64,23.25 v94.64,22 | U6.5 93.48,13.41 v92.11,13.41
  Top 0.508: 111.53,37.21 111.53,34.92 112.28,34.17 C3.1 | 111.53,37.21 112.19,36.55 114.3,36.55 114.66,36.18 115.73,36.18 116.16,35.75 D2.2 | v106.45,35.56 107.72,36.83 | 107.72,36.83 108.6,37.72 A1.4 111.02,37.72 111.53,37.21 | 107.72,36.83 107.72,34.92 v106.45,33.66
  Bottom 0.254: D101.8 v191.54,26.67 | D101.3 v191.54,7.81 | v180.26,23.5 D108.A | D100.A 180.08,4.45 v180.16,4.37 | D105.A 116.88,16.97 v116.88,17.24 | D102.A v166.52,15.24 | D103.A v150.77,15.24 | D104.A 135.41,15.24 v136.4,14.25 | D106.A 103.37,17.06 v103.14,17.29 | D107.A v90.06,15.24
  pour Route15: -0.23,26.67 -0.23,-0.64 208.68,-0.64 209.32,0 209.32,29.21 194.71,43.81 103.27,43.81 13.74,43.81 -0.23,29.84
+12V
  Top 0.254: C15.2 51.32,19.68 U5.2
  Top 0.508: 46.76,32.38 69.06,32.38 71.67,34.99 D1.2 71.81,36.97 74.07,39.24 81.87,39.24 82.69,40.06 92.58,40.06 94.43,41.91 101.65,41.91 | 46.76,32.38 48.03,31.11 48.03,21.7 49.3,20.43 C15.2 | XF1.3 XF1.4 170.42,31.93 168.43,31.93 166.07,34.29 154.07,34.29 152.17,36.2 134.19,36.2 131.62,38.76 127.46,38.76 126.33,39.88 121.88,39.88 121.13,40.64 113.43,40.64 112.16,41.91 101.65,41.91 | 22.13,22.37 21.99,22.51 21.99,25.4 | 22.13,22.37 24.58,19.93 J3.1 | 21.99,25.4 21.99,28.73 25.65,32.38 46.76,32.38 | D4.3 19.82,20.05 22.13,22.37 | TP3.1 19.45,22.86 21.99,25.4 | A1.2 101.11,41.37 101.65,41.91
A2
  Top 0.254: RN2.1 134.28,28.98 129.71,28.98 128.77,28.04 128.77,23.5 130.41,21.86 U3.12
AMS_LED-  (via drill 0.35)
  Top 0.254: R1.1 74.75,36.24 v73.51,35
  Bottom 0.254: D100.C 167.66,4.45 164.5,1.29 77.95,1.29 73.51,5.73 v73.51,35
B2
  Top 0.254: RN2.2 136.25,25.8 133.47,28.57 130.07,28.57 129.18,27.69 129.18,23.8 130.47,22.5 U3.13
BRB_LED-  (via drill 0.35)
  Top 0.254: R2.1 77.66,33.13 83.93,33.13 84.47,32.58 84.47,24.67 85.14,24 87.37,24 88.87,22.49 88.87,20.07 v89.64,19.31
  Bottom 0.254: D103.C 136.4,15.24 132.41,19.23 89.72,19.23 v89.64,19.31
BTN_LAUNCH_READ  (via drill 0.35)
  Top 0.254: J4.1 187.9,19.23 180.11,11.43 165.54,11.43 162.62,8.51 v162.62,5.71 | U7.26 107.55,14.7 110.48,11.77 v110.48,11.61
  Bottom 0.254: v110.48,11.61 110.48,10.85 112.22,9.12 133.52,9.12 137.67,4.97 161.87,4.97 v162.62,5.71
BTN_MARK_READ  (via drill 0.35)
  Top 0.254: v120.42,6.35 116.07,10.7 U7.10 | v165.44,5.82 187.47,5.82 190.9,9.25 J4.5
  Bottom 0.254: v165.44,5.82 162.04,2.41 124.35,2.41 v120.42,6.35
BTN_MC_CYCLE_READ  (via drill 0.35)
  Top 0.254: v112.01,10.41 112.01,11.03 114.06,13.08 115.07,13.08 U7.13 | v164.05,6.6 184.92,6.6 187.9,9.59 J4.4
  Bottom 0.254: v112.01,10.41 112.9,9.53 134.11,9.53 137.03,6.6 v164.04,6.6 v164.05,6.6
BTN_MODE_READ  (via drill 0.35)
  Top 0.254: v120.85,7.54 116.89,11.5 U7.11 | v163.06,4.52 163.64,5.11 190.93,5.11 195.17,9.35 195.17,18.02 J4.3
  Bottom 0.254: v163.06,4.52 162.06,3.52 138.36,3.52 134.33,7.54 v120.85,7.54
BTN_START_READ  (via drill 0.35)
  Top 0.254: v108.83,14.86 108.19,15.5 U7.25 | v164.07,8.48 178.76,8.48 187.03,16.75 189.63,16.75 190.9,18.02 J4.2
  Bottom 0.254: v108.83,14.86 110.74,14.86 115.21,10.39 134.47,10.39 136.39,8.47 164.06,8.47 v164.07,8.48
BUZZER_CTRL  (via drill 0.35)
  Top 0.254: v82.18,11.16 70.74,11.16 R11.2 60.94,20.95 U5.8 | v108.11,13.07 108.11,13.53 107.73,13.9 U7.27
  Bottom 0.254: v82.18,11.16 82.2,11.18 106.83,11.18 108.11,12.46 v108.11,13.07
C2
  Top 0.254: RN2.3 136.28,25 133.12,28.17 130.3,28.17 129.58,27.46 129.58,24.08 130.51,23.16 U3.14
CANH
  Top 0.254: J3.4 32.38,12.26 31.09,10.97 31.09,9.95 39.95,1.09 135.31,1.09 142.64,8.41 142.64,29 142.64,29.01 143.94,30.31 143.94,31.52 145.43,33.02 U2.7 147.72,33.02 148.36,32.38 156.46,32.38 162.96,25.88 162.96,25.06 J2.4
CANL
  Top 0.254: J3.3 29.38,12.34 30.69,11.03 30.69,9.72 39.75,0.66 136.6,0.66 143.04,7.11 143.04,28.84 144.34,30.14 144.34,31.04 145.05,31.75 U2.6 156.36,31.75 162.33,25.78 162.33,24.78 J2.3
CIPO  (via drill 0.35)
  Top 0.254: 122.32,15.6 116.64,15.6 115.19,15.6 U7.16 | v127.34,33.16 127.02,33.16 126.86,33.31 U1.17 | v129,32.36 129,29.67 128.37,29.03 128.37,19.28 125.86,16.77 124.69,15.6 122.32,15.6 | 122.32,15.6 123.59,14.33 J5.9 | U3.3 123.39,25.75 v123.11,26.04
  Bottom 0.254: v127.34,33.16 128.21,33.16 v129,32.36 129,31.93 v123.11,26.04
CLK  (via drill 0.35)
  Top 0.254: U7.17 113.69,17.84 113.84,17.98 115.13,17.98 117.09,16.02 122.89,16.02 124.55,17.69 v125.19,17.69 127.55,20.05 127.55,26.67 | 127.55,26.67 127.55,28.42 126.77,29.21 122.32,29.21 120.42,31.11 120.42,33.66 122.03,35.27 U1.14 | v125.75,14.86 126.13,14.48 J5.7 | U3.1 127.17,27.05 127.55,26.67
  Bottom 0.254: v125.19,17.69 125.75,17.12 v125.75,14.86
COPI  (via drill 0.35)
  Top 0.254: U1.16 127.8,33.97 128.26,33.5 128.26,30.71 127.98,30.43 v127.98,29.84 127.96,29.82 127.96,19.46 125.04,16.54 v124.43,16.54 | U3.2 125.63,26.41 125.86,26.17 v126.62,26.17 | J5.1 133.75,15.88 132.48,17.14 126.82,17.14 125.01,15.34 | v124.43,14.86 124.53,14.86 125.01,15.34 | U7.15 117.66,14.71 118.39,13.98 118.39,11.79 122.18,8 123.73,8 125.01,9.28 125.01,15.34
  Bottom 0.254: v127.98,29.84 126.77,28.63 126.77,26.31 v126.62,26.17 | v124.43,16.54 v124.43,14.86
CS_CAN  (via drill 0.35)
  Top 0.254: v116.59,21.28 116.47,21.16 116.47,19.19 v118.14,17.53 | U1.18 126.49,32.66 126.77,32.38 126.77,30.81 126.21,30.25 125.59,30.25 v125.33,30 | U7.14 116.29,13.9 v116.99,13.21
  Bottom 0.254: v125.33,30 125.31,30 v116.59,21.28 | v116.99,13.21 119.99,13.21 120.64,13.86 120.64,16 119.24,17.4 118.26,17.4 118.14,17.52 v118.14,17.53
CS_IO  (via drill 0.35)
  Top 0.254: R15.2 121.69,12.06 v122.32,12.7 | U3.7 126.17,23.16 126.64,22.68 126.64,21.12 v122.81,17.29
  Bottom 0.254: v122.81,17.29 122.81,13.19 v122.32,12.7
D2
  Top 0.254: RN2.4 136.35,24.2 132.79,27.76 130.65,27.76 129.99,27.1 129.99,24.56 130.75,23.8 U3.15
E2
  Top 0.254: U3.16 132.41,24.45 134.71,22.16 RN4.1
F2  (via drill 0.35)
  Top 0.254: U3.17 133.16,25.11 v134.77,23.5 | v135.45,21.37 136.65,21.37 RN4.2
  Bottom 0.254: v134.77,23.5 134.77,21.84 135.24,21.37 v135.45,21.37
G2
  Top 0.254: RN4.3 137.36,20.55 137.57,20.76 137.57,22.82 137.15,23.24 136.16,23.24 133.65,25.75 U3.18
GND  (via drill 0.35, 0.76)
  Top 0.254: C7.2 v132.48,30.48 | v129.94,37.47 130.19,37.22 U1.10 | v62.63,17.14 62.63,17.57 R11.1 | C14.2 118.41,21.21 v118.56,21.21 | C9.2 v117.24,23.47 | C8.2 v117.24,25.98 | C3.2 113.95,35.67 v114.7,34.92 | v119.45,21.21 119.74,21.5 C10.2 120.9,21.48 C11.2 | C2.2 122.44,38.1 v122.96,38.1 | v111.2,22.2 111.2,21.09 C13.2 110.49,20.29 U7.21 | U5.5 v58.82,17.14 | X2.4 108.26,5.14 v107.84,4.72 | X2.2 113.98,3.54 v113.99,3.53 | v117.24,3.17 116.49,2.42 C19.2 | X1.4 119.45,37.53 v119.45,36.37 | X1.2 115.78,39.8 v114.95,39.8 | J4.6 193.9,12.53 v193.44,12.06 | C15.1 49.41,18.93 v49.3,19.05 | U7.5 111.29,7.54 111.14,7.39 109.87,7.39 109.69,7.58 U7.3 109.69,9.39 109.25,9.82 v109.25,11.06 | J5.4 J5.6 J5.8 J5.10 122.32,6.35 v121.69,6.35 | U3.5 U3.4 125.89,25.11 v125.9,25.12 | U3.9 125.63,21.86 v125.82,21.66 | v113.94,38.2 112.86,38.2 C1.2 | v34.06,17.14 34.06,18.25 J3.2 | R23.2 v158.52,4.23 | R22.2 v155.98,4.23 | R21.2 v153.44,4.23 | U2.8 v145.82,34.29 | C4.2 C5.2 140.11,33.02 v140.74,33.02 U2.2 | C6.2 v121.54,31.37 v121.53,31.37 | C16.2 200.53,17.97 v200.53,19.63 200.53,19.9 C12.2 | v105.96,5.05 105.96,3.93 C18.2 | v24.53,18.03 D4.1 21.99,17.86 21.99,17.14 21.36,16.51 18.18,16.51 TP5.1 | v109.93,21.97 RN3.8 RN3.7 | R24.2 161.64,6.72 v161.64,4.23 | Q8.2 85.52,4.71 v85.52,6.53 | v98.42,16.2 99.3,17.07 RN5.1 RN5.2 RN5.3 RN5.4 | v86.88,38.93 86.87,38.95 Q1.2 | v87.39,21.56 85.81,21.56 Q5.2 | Q2.2 82.95,35.94 v83.02,35.87 | Q4.2 v85.57,28.74 v85.56,28.75 | v102.76,12.52 102.58,12.7 DN1.2 | Q3.2 86.81,33.23 v86.86,33.27 | v86.75,10.37 Q7.2 | DN2.2 100.73,3.41 100.96,3.19 v101.38,3.19 | v98.47,5.79 98.6,5.79 RN7.4 RN7.3 RN7.2 RN7.1 | v84.4,16.49 85.16,16.49 Q6.2
  Top 0.254: U6.3 95.64,14.75 v95.64,16 | U4.3 97.88,24.65 v97.94,24.71 | RN3.3 107.32,25 v107.33,25.02
  Top 0.508: R6.1 112.8,32.38 112.16,33.02 109.62,33.02 109.11,32.51 A1.11 108.86,31.75 v107.08,31.75 | A1.7 v104.54,31.75 | A1.3 105.68,37.34 v103.91,35.56 | v166.31,19.63 165.79,19.11 J2.8
  pour Route2: 2.27,4.46 0.03,25.11 arc-88 3.96,30.16 95.14,42.98 arc-16 110.14,42.98 205.11,29.63 arc-86 209.06,24.74 207.62,4.64 arc-86 202.64,0 7.24,0 arc-84
IMD_LED-  (via drill 0.35)
  Top 0.254: v81.74,20.13 81.42,19.81 R10.1
  Bottom 0.254: D108.C 171.82,23.5 170.22,25.09 141.34,25.09 136.38,20.13 v81.74,20.13
LED_AMS_CTRL  (via drill 0.35)
  Top 0.254: RN5.7 101.13,16.27 100.6,15.75 | 100.6,15.75 100.58,15.72 100.58,14.35 100.2,13.97 98.23,13.97 97.75,13.49 97.75,11.37 98.11,11 103.49,11 | 100.6,15.75 100.6,17.47 100.2,17.87 96.91,17.87 89.28,25.5 RN1.1 | DN2.6 102.35,2.23 103.91,3.79 v103.91,5.05 | 103.49,11 103.14,10.65 v103.14,9.65 | U7.30 104.99,11.5 104.49,11 103.49,11
  Bottom 0.254: v103.14,9.65 103.91,8.89 v103.91,5.05
LED_IMD_CTRL  (via drill 0.35)
  Top 0.254: DN2.4 91.52,2.23 v90.47,3.27 | U7.31 105.72,10.7 103.2,8.19 RN7.8 101.44,8.37 101.44,9.01 101,9.46 RN6.4 90.55,9.89 90.29,10.16 v89.65,10.16
  Bottom 0.254: v90.47,3.27 89.65,4.09 v89.65,10.16
LED_MC_ERR_CTRL
  Top 0.254: U7.1 108.09,7.41 107.27,6.58 RN7.6 100.97,6.58 100.73,6.35 100.73,5.41 100.74,5.4 100.08,4.75 DN2.3 91.97,4.12 90.55,5.55 RN6.1
LED_MODE_CTRL
  Top 0.254: DN2.5 100.73,2.53 100.28,2.98 92.54,2.98 89.66,5.87 89.66,8.08 90.24,8.65 RN6.3 98.6,8.65 98.99,9.04 100.29,9.04 100.74,8.6 100.74,7.83 101.19,7.38 RN7.7 103.04,7.38 105.55,9.9 U7.32
LED_START_CTRL  (via drill 0.35)
  Top 0.254: RN7.5 102.64,5.79 | 102.64,5.79 107.15,5.79 108.99,7.62 108.99,8.4 U7.2 | RN6.2 98.01,7.86 v98.01,7.82 | DN2.1 102.34,4.12 102.64,4.42 v102.64,5.05 102.61,5.08 102.64,5.11 102.64,5.79
  Bottom 0.254: v98.01,7.82 99.78,6.05 101.64,6.05 v102.64,5.05
MCU_LED-  (via drill 0.35)
  Top 0.254: R25.1 80.36,2 v81.64,2
  Bottom 0.254: v81.64,2 164.64,2 166.64,4 166.64,9.33 162.33,13.64 D102.C
MODE_LED-  (via drill 0.35)
  Top 0.254: v79.64,17 79.54,16.91 R14.1
  Bottom 0.254: D106.C 99.35,17.26 79.89,17.26 v79.64,17
N$1
  Top 0.254: U1.9 128.58,36.56 126.29,38.85 C2.1 121.67,38.84 121.05,38.84 120.71,39.18 X1.1
N$3
  Top 0.254: X2.3 114.12,5.14 | C19.1 114.12,5.14 | 114.12,5.14 113.69,5.57 U7.8
N$4
  Top 0.254: U7.20 111.27,16.93 111.27,19.53 C13.1
N$5
  Top 0.254: R25.2 82.72,4.57 Q8.3
N$6
  Top 0.254: Q6.3 83.57,14.86 82.72,14.01 R14.2
N$7
  Top 0.254: Q5.3 83.57,21.32 82.98,21.91 R10.2
N$8
  Top 0.254: R1.2 76.5,38.35 83.22,38.35 Q1.3
N$9
  Top 0.254: Q4.3 83.42,26.43 R8.2
N$10
  Top 0.254: RN6.7 88.15,7.86 87.51,8.49 Q7.1
N$11
  Top 0.254: 106.6,2.42 108.25,2.42 X2.1 | 106.6,2.42 C18.1 | 106.6,2.42 106.6,2.44 107.08,2.92 107.08,5.08 108.99,6.99 112.54,6.99 112.89,7.33 U7.7
N$12
  Top 0.254: RN1.5 87.48,31.16 86.14,32.5 85.11,32.5 84.85,32.76 84.85,33.28 84.07,34.06 Q2.1
N$13  (via drill 0.35)
  Top 0.254: RN2.8 140.24,26.6 v141.64,28
  Bottom 0.254: v141.64,28 141.83,28.19 185.54,28.19 D101.7
N$14  (via drill 0.35)
  Top 0.254: RN2.7 140.82,25.8 v141.64,26.62
  Bottom 0.254: v141.64,26.62 142.37,27.35 184.5,27.35 186.46,25.4 D101.6
N$15  (via drill 0.35)
  Top 0.254: RN2.6 141.02,25 v141.64,24.38
  Bottom 0.254: D101.4 170.35,24.38 v141.64,24.38
N$16  (via drill 0.35)
  Top 0.254: RN4.6 140.08,20.55 v141.64,19
  Bottom 0.254: v141.64,19 142.14,18.49 172.14,18.49 181.64,9 181.64,4 184.64,1 197.64,1 201.64,5 201.64,19.72 D101.10
N$17  (via drill 0.35)
  Top 0.254: RN4.7 140.6,21.36 v141.64,20.32
  Bottom 0.254: v141.64,20.32 141.89,20.57 171.06,20.57 182.64,9 182.64,4 184.64,2 196.64,2 199.64,5 199.64,19.18 D101.9
N$18  (via drill 0.35)
  Top 0.254: RN4.8 141.12,22.16 v141.64,21.64
  Bottom 0.254: v141.64,21.64 171,21.64 183.64,9 183.64,5 185.64,3 193.88,3 D101.1
N$19  (via drill 0.35)
  Top 0.254: RN2.5 140.44,24.2 v141.64,23
  Bottom 0.254: v141.64,23 170.64,23 184.64,9 184.64,5 185.64,4 193,4 194.08,5.08 D101.2
N$21
  Top 0.254: RN3.1 116.61,31.45 D2.1
N$22
  Top 0.254: RN6.8 88.75,4.05 87.47,2.77 Q8.1
N$23
  Top 0.254: Q2.3 79.48,34.85 R2.2
N$26
  Top 0.254: RN1.6 87.44,29.02 86.91,29.02 85.57,30.36 Q3.1
N$28
  Top 0.254: U5.7 58.82,19.68 59.61,18.9 59.61,9.68 57.44,7.5 C17.1 LS100.M
N$29
  Top 0.254: U7.12 115.99,12.3 116.22,12.06 R15.1
N$30
  Top 0.508: R6.2 112.8,28.57 112.16,27.94 109.62,27.94 109.11,28.45 A1.6
N$34
  Top 0.254: Q7.3 82.72,10.28 R20.2
N$35
  Top 0.254: Q5.1 85.65,20 87.64,20 88.42,19.21 88.42,9.79 RN6.5
N$36
  Top 0.254: RN6.6 88.11,8.65 87.64,9.13 87.64,13 86.43,14.21 Q6.1
N$37
  Top 0.254: Q4.1 86.3,26.36 86.3,27.64 86.84,28.18 RN1.7
N$38
  Top 0.254: Q1.1 88.25,34.39 88.25,27.69 87.94,27.38 RN1.8
N$39
  Top 0.254: R13.1 55.84,17.78 55.84,17.97 | 55.84,17.97 56.28,18.41 U5.6 | 55.84,17.97 55.84,25.59 57.98,27.74 LS100.G
N$41
  Top 0.254: U1.2 132.11,32.02 132.48,32.38 132.48,33.66 133.12,34.29 J1.2 133.54,34.92 133.64,35.03 134.17,35.56 135.66,35.56 136.29,34.92 136.29,31.75 136.6,31.44 139.17,31.44 140.13,30.48 U2.4
N$42
  Top 0.254: C1.1 113.62,39.71 115.7,37.63 116.35,37.63 X1.3 116.4,37.29 118.04,35.65 121.64,35.65 123.84,37.85 126.53,37.85 128.46,35.91 U1.8
N$43
  Top 0.508: XF1.2 XF1.1 168.24,19.18 165.55,21.87 160.48,21.87 160.24,22.11 160.24,25.39 159.64,26 155.87,26 155.29,25.41 J2.1
N$44
  Top 0.254: D3.2 108.89,18.7 U7.23
N$46
  Top 0.254: R3.2 124.86,32.6 124.86,32.38 125.23,32.02 U1.19
N$48
  Top 0.254: RN1.2 91.01,28.18 U4.4 94.99,24.65 95.64,24 95.64,23 100.36,18.28 | 100.36,18.28 100.37,18.28 101.57,17.07 RN5.8 | DN1.1 101.45,12.03 100.98,12.49 100.98,13.56 101.6,14.17 102.51,14.17 105.62,17.29 105.62,17.87 105.21,18.29 100.37,18.29 100.36,18.28
N$50
  Top 0.254: R9.1 47.58,17.14 U5.4 54.14,15.42 R13.2 54.14,11.79 C17.2
N$51
  Top 0.254: J1.1 133.54,32.59 R4.2
N$52
  Top 0.254: R4.1 135.24,31.75 | 135.24,31.75 135.24,30.58 C7.1 | 135.24,31.75 136.51,30.48 R7.1
N$53
  Top 0.254: 139.02,29.82 142.87,29.82 143.53,30.48 143.53,34.04 143.28,34.29 U2.1 | R7.2 139.05,29.84 139.02,29.82 | U1.1 131.45,29.61 131.67,29.39 138.59,29.39 139.02,29.82
N$54
  Top 0.254: R9.2 42.74,27.73 LS100.F
N$55
  Top 0.254: Q3.3 75.64,32.29 R5.2
N$56  (via drill 0.35)
  Top 0.254: v91.64,22 v91.64,16.55 U6.4 | v91.33,29.72 89.34,29.72 RN1.4 | RN5.5 101.53,14.58 101.43,14.58 100.2,13.35 DN1.4 98.9,13.35 v98.79,13.24
  Bottom 0.254: v91.64,22 91.64,29.41 v91.33,29.72 | v98.79,13.24 94.94,13.24 v91.64,16.55
N$60
  Top 0.254: C14.1 114.85,20.04 113.07,18.27 | 113.07,18.27 112.89,18.08 U7.18 | L1.1 113.07,18.27
RESET  (via drill 0.35)
  Top 0.254: R12.2 128.67,15.91 J5.5 128.67,9.53 127.4,8.26 v126.23,8.26 | U7.29 107.58,12.3 108.35,11.53 v108.35,10.16
  Bottom 0.254: v108.35,10.16 108.35,7.62 108.99,6.99 118.89,6.99 120.15,8.25 v126.22,8.25 v126.23,8.26
S/D_F_LED-  (via drill 0.35)
  Top 0.254: R5.1 v75.49,28.83
  Bottom 0.254: D105.C 114.69,15.24 111.93,18 78.19,18 76.97,19.23 76.97,28.35 76.49,28.83 v75.49,28.83
S/D_G_LED-  (via drill 0.35)
  Top 0.254: R8.1 74.57,24.73 74.57,23.26 v77.73,20.1
  Bottom 0.254: v77.73,20.1 79.23,18.6 128.49,18.6 D104.C
SHUTDOWN_F
  Top 0.254: TP2.1 146.64,25.41 150.64,21.41 158.58,21.41 160.87,19.11 J2.7 161.29,18.77 158.52,16 R19.1
SHUTDOWN_F_READ  (via drill 0.35)
  Top 0.254: v113.56,15.37 112.86,15.37 112.09,16.14 U7.19 112.09,22.55 111.6,23.03 104.4,23.03 101.96,25.47 94.66,25.47 91.15,28.98 RN1.3 | R23.1 R19.2 157.2,10.35 v157.18,10.34 | v104.41,17.2 102.68,15.47 RN5.6 | DN1.3 103.64,13.35 104.97,14.68 v104.97,15
  Bottom 0.254: v157.18,10.34 155.73,11.79 117.3,11.79 113.72,15.37 v113.56,15.37 113.52,15.37 111.69,17.2 106.25,17.2 | v104.41,17.2 106.25,17.2 | v104.97,15 104.97,15.91 106.25,17.2
SHUTDOWN_G
  Top 0.254: TP4.1 156.4,21 J2.6 155.98,16.8 R18.1
SHUTDOWN_G_READ  (via drill 0.35)
  Top 0.254: U7.24 108.09,17.66 107.46,18.29 106.35,18.29 | 106.35,18.29 100.64,24 U4.2 | R18.2 155.98,10 | 155.98,10 R22.1 | 155.98,10 155.15,9.18 v154.64,9.18 | v106.64,16.41 106.64,18 106.35,18.29
  Bottom 0.254: v154.64,9.18 136.26,9.18 134.64,10.79 115.38,10.79 110.6,15.57 107.48,15.57 v106.64,16.41
SHUTDOWN_H
  Top 0.254: TP6.1 152.17,16 153.4,17.23 | 153.4,17.23 J2.5 | R17.1 153.44,17.2 153.4,17.23
SHUTDOWN_H_READ  (via drill 0.35)
  Top 0.254: U7.22 109.69,16.01 110.28,15.42 v111.8,15.42 | R17.2 R21.1 151.44,10.46 151.5,10.46 v151.66,10.31
  Bottom 0.254: v151.66,10.31 150.71,11.25 115.97,11.25 v111.8,15.42
SHUTDOWN_I
  Top 0.254: J2.2 158.29,22.97 160.04,21.21 161.68,21.21 162.2,20.69 162.2,17.54 161.64,16.97 R16.1 160.66,11.13 146.76,11.13 TP7.1
SHUTDOWN_I_READ  (via drill 0.35)
  Top 0.254: R24.1 161.59,10.36 R16.2 159.91,8.68 v159.91,7.67 | U7.9 113.97,9.9 v113.64,10.23 | v97.17,13.97 95.77,13.97 U6.2
  Bottom 0.254: v159.91,7.67 136.54,7.67 134.27,9.93 113.94,9.93 v113.64,10.23 109.9,13.97 v97.17,13.97
START_LED-  (via drill 0.35)
  Top 0.254: R20.1 79.64,8.44 v79.64,7
  Bottom 0.254: v79.64,7 80.47,7.84 80.47,10.45 85.26,15.24 D107.C
STATUS_12V
  Top 0.254: RN3.2 108.12,25.64 106.99,26.77 98.5,26.77 87.26,38 84.76,38 84.13,37.37 73.71,37.37 D1.1
STATUS_TEENSY
  Top 0.254: D3.1 106.89,20.13 107.32,20.55 RN3.6

### Text on the board
tPlace: INERTIA | SHUTDOWN_H | COCKPIT_BRB | HyTech Racing 2022 / Dashboard rev5 / Designed by Youssef Jaafar
bPlace: IMD | START | MODE | SSOK | INERTIA | BRB | MCU | AMS